# EAGLE schematic Cube-Panel (EAGLE 7.7.0)
Assembly variants: P1, P2, P3, P4, P5, P6

## Sheet 1 of 4
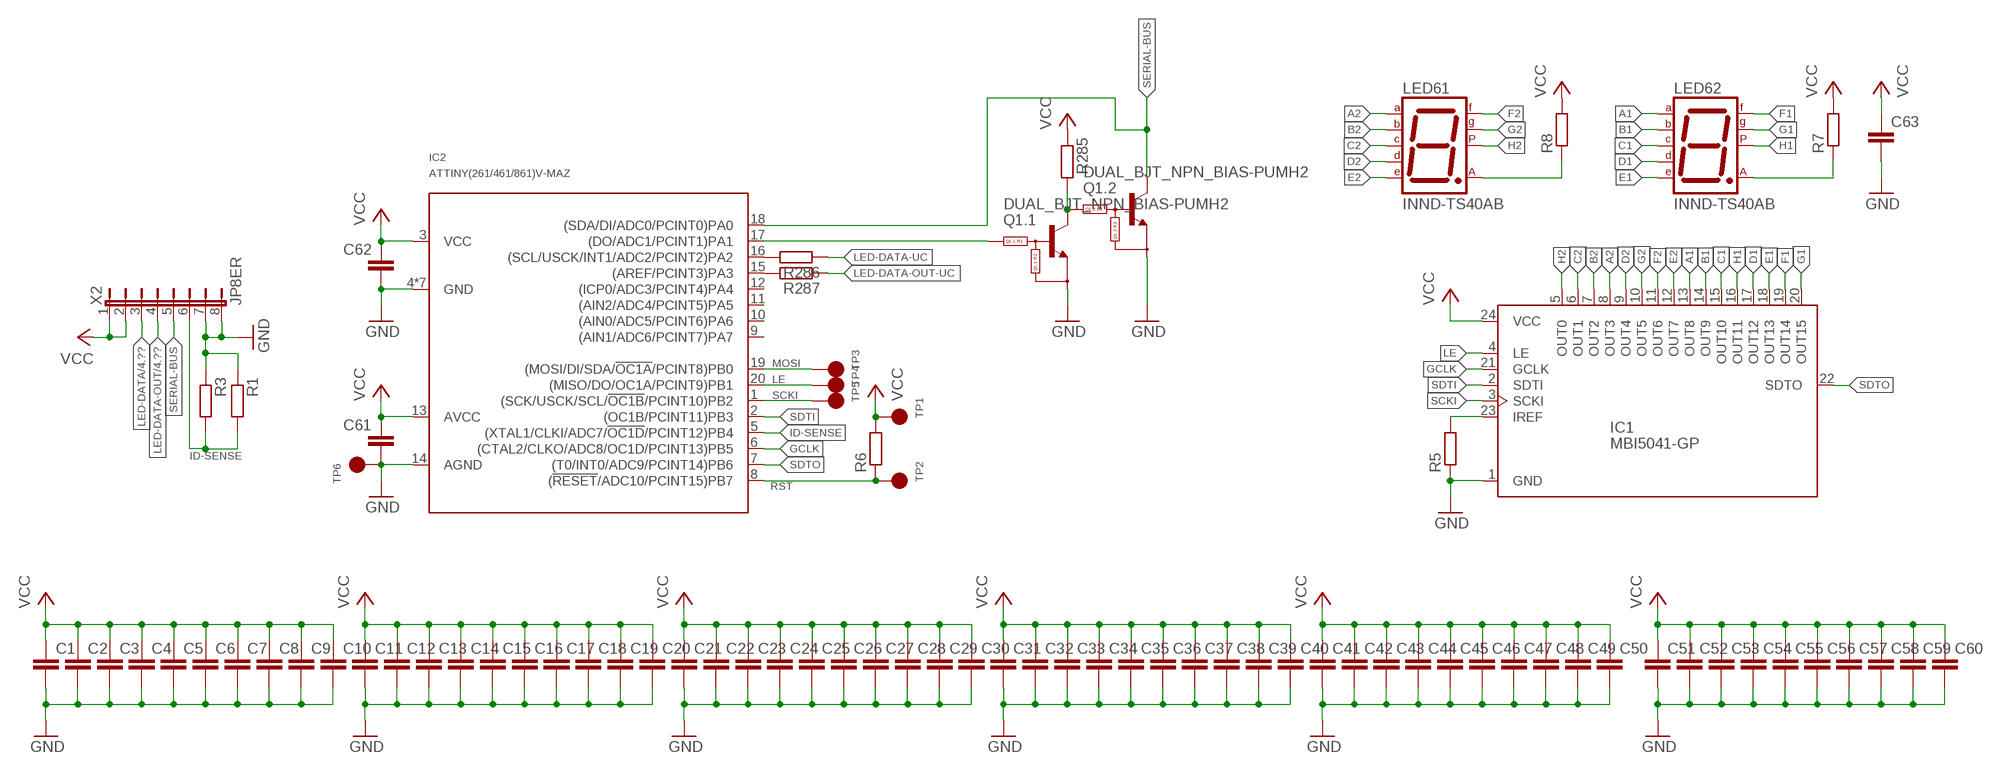
[diagram p0: schematic, sheet 1]

### Parts
C1  KONDENSATOR-0603  [0603]
C2  KONDENSATOR-0603  [0603]
C3  KONDENSATOR-0603  [0603]
C4  KONDENSATOR-0603  [0603]
C5  KONDENSATOR-0603  [0603]
C6  KONDENSATOR-0603  [0603]
C7  KONDENSATOR-0603  [0603]
C8  KONDENSATOR-0603  [0603]
C9  KONDENSATOR-0603  [0603]
C10  KONDENSATOR-0603  [0603]
C11  KONDENSATOR-0603  [0603]
C12  KONDENSATOR-0603  [0603]
C13  KONDENSATOR-0603  [0603]
C14  KONDENSATOR-0603  [0603]
C15  KONDENSATOR-0603  [0603]
C16  KONDENSATOR-0603  [0603]
C17  KONDENSATOR-0603  [0603]
C18  KONDENSATOR-0603  [0603]
C19  KONDENSATOR-0603  [0603]
C20  KONDENSATOR-0603  [0603]
C21  KONDENSATOR-0603  [0603]
C22  KONDENSATOR-0603  [0603]
C23  KONDENSATOR-0603  [0603]
C24  KONDENSATOR-0603  [0603]
C25  KONDENSATOR-0603  [0603]
C26  KONDENSATOR-0603  [0603]
C27  KONDENSATOR-0603  [0603]
C28  KONDENSATOR-0603  [0603]
C29  KONDENSATOR-0603  [0603]
C30  KONDENSATOR-0603  [0603]
C31  KONDENSATOR-0603  [0603]
C32  KONDENSATOR-0603  [0603]
C33  KONDENSATOR-0603  [0603]
C34  KONDENSATOR-0603  [0603]
C35  KONDENSATOR-0603  [0603]
C36  KONDENSATOR-0603  [0603]
C37  KONDENSATOR-0603  [0603]
C38  KONDENSATOR-0603  [0603]
C39  KONDENSATOR-0603  [0603]
C40  KONDENSATOR-0603  [0603]
C41  KONDENSATOR-0603  [0603]
C42  KONDENSATOR-0603  [0603]
C43  KONDENSATOR-0603  [0603]
C44  KONDENSATOR-0603  [0603]
C45  KONDENSATOR-0603  [0603]
C46  KONDENSATOR-0603  [0603]
C47  KONDENSATOR-0603  [0603]
C48  KONDENSATOR-0603  [0603]
C49  KONDENSATOR-0603  [0603]
C50  KONDENSATOR-0603  [0603]
C51  KONDENSATOR-0603  [0603]
C52  KONDENSATOR-0603  [0603]
C53  KONDENSATOR-0603  [0603]
C54  KONDENSATOR-0603  [0603]
C55  KONDENSATOR-0603  [0603]
C56  KONDENSATOR-0603  [0603]
C57  KONDENSATOR-0603  [0603]
C58  KONDENSATOR-0603  [0603]
C59  KONDENSATOR-0603  [0603]
C60  KONDENSATOR-0603  [0603]
C61  KONDENSATOR-0603  [0603]
C62  KONDENSATOR-0603  [0603]
C63  KONDENSATOR-0603  [0603]
IC1  MBI5041-GP  [SSOP24-150-0.635]
IC2  ATTINY(261/461/861)V-MAZ  [QFN-20]
LED61  INND-TS40AB  [7SEG-13]
LED62  INND-TS40AB  [7SEG-13]
Q1  DUAL_BJT_NPN_BIAS-PUMH2  [SOT-363(SC-88)]
R1  WIDERSTAND-0603  [0603]
R3  WIDERSTAND-0603  [0603]
R5  WIDERSTAND-0603  [0603]
R6  WIDERSTAND-0603  [0603]
R7  WIDERSTAND-0603  [0603]
R8  WIDERSTAND-0603  [0603]
R285  WIDERSTAND-0603  [0603]
R286  WIDERSTAND-0603  [0603]
R287  WIDERSTAND-0603  [0603]
TP1  TP  [TP[1.5][R]]
TP2  TP  [TP[1.5][R]]
TP3  TP  [TP[1.5][R]]
TP4  TP  [TP[1.5][R]]
TP5  TP  [TP[1.5][R]]
TP6  TP  [TP[1.5][R]]
X2  JP8ER  [JP8]

### Nets
A1: IC1.13(OUT8) LED62.10(A)
A2: IC1.8(OUT3) LED61.10(A)
B1: IC1.14(OUT9) LED62.9(B)
B2: IC1.7(OUT2) LED61.9(B)
C1: IC1.15(OUT10) LED62.8(C)
C2: IC1.6(OUT1) LED61.8(C)
D1: IC1.17(OUT12) LED62.5(D)
D2: IC1.9(OUT4) LED61.5(D)
E1: IC1.18(OUT13) LED62.1(E)
E2: IC1.12(OUT7) LED61.1(E)
F1: IC1.19(OUT14) LED62.2(F)
F2: IC1.11(OUT6) LED61.2(F)
G1: IC1.20(OUT15) LED62.3(G)
G2: IC1.10(OUT5) LED61.3(G)
GCLK: IC1.21(GCLK) IC2.6((CTAL2/CLKO/ADC8/OC1D/PCINT13)PB5)
GND: C1.P$2 C2.P$2 C3.P$2 C4.P$2 C5.P$2 C6.P$2 C7.P$2 C8.P$2 C9.P$2 C10.P$2 C11.P$2 C12.P$2 C13.P$2 C14.P$2 C15.P$2 C16.P$2 C17.P$2 C18.P$2 C19.P$2 C20.P$2 C21.P$2 C22.P$2 C23.P$2 C24.P$2 C25.P$2 C26.P$2 C27.P$2 C28.P$2 C29.P$2 C30.P$2 C31.P$2 C32.P$2 C33.P$2 C34.P$2 C35.P$2 C36.P$2 C37.P$2 C38.P$2 C39.P$2 C40.P$2 C41.P$2 C42.P$2 C43.P$2 C44.P$2 C45.P$2 C46.P$2 C47.P$2 C48.P$2 C49.P$2 C50.P$2 C51.P$2 C52.P$2 C53.P$2 C54.P$2 C55.P$2 C56.P$2 C57.P$2 C58.P$2 C59.P$2 C60.P$2 C61.P$2 C62.P$2 C63.P$2 IC1.1(GND) IC2.4(GND) IC2.14(AGND) IC2.PAD$1(GND) IC2.PAD$2(GND) IC2.PAD$3(GND) IC2.PAD$4(GND) IC2.PAD$5(GND) IC2.PAD(GND) Q1.1(.1:E) Q1.4(.2:E) R1.P$1 R3.P$1 R5.P$1 TP6.P$1 X2.7 X2.8 ; also sheet 3
H1: IC1.16(OUT11) LED62.7(DP)
H2: IC1.5(OUT0) LED61.7(DP)
ID-SENSE: IC2.5((XTAL1/CLKI/ADC7/!OC1D!/PCINT12)PB4) R1.P$2 R3.P$2 X2.6
LE: IC1.4(LE) IC2.20((MISO/DO/OC1A/PCINT9)PB1) TP4.P$1
LED-DATA: X2.3 ; also sheet 4
LED-DATA-OUT: X2.4 ; also sheet 4
LED-DATA-OUT-UC: R287.P$1 ; also sheet 4
LED-DATA-UC: R286.P$1 ; also sheet 4
MOSI: IC2.19((MOSI/DI/SDA/!OC1A!/PCINT8)PB0) TP3.P$1
N$2: IC1.23(IREF) R5.P$2
N$6: IC2.16((SCL/USCK/INT1/ADC2/PCINT2)PA2) R286.P$2
N$18: Q1.5(.2:B) Q1.6(.1:C) R285.P$2
N$19: IC2.15((AREF/PCINT3)PA3) R287.P$2
N$26: LED61.6(CA2) R8.P$1
N$35: LED62.6(CA2) R7.P$1
RST: IC2.8((!RESET!/ADC10/PCINT15)PB7) R6.P$1 TP2.P$1
SCKI: IC1.3(SCKI) IC2.1((SCK/USCK/SCL/!OC1B!/PCINT10)PB2) TP5.P$1
SDTI: IC1.2(SDTI) IC2.2((OC1B/PCINT11)PB3)
SDTO: IC1.22(SDTO) IC2.7((T0/INT0/ADC9/PCINT14)PB6)
SERIAL-BUS: IC2.18((SDA/DI/ADC0/PCINT0)PA0) Q1.3(.2:C) X2.5
SERIAL-BUS-TX: IC2.17((DO/ADC1/PCINT1)PA1) Q1.2(.1:B)
VCC: C1.P$1 C2.P$1 C3.P$1 C4.P$1 C5.P$1 C6.P$1 C7.P$1 C8.P$1 C9.P$1 C10.P$1 C11.P$1 C12.P$1 C13.P$1 C14.P$1 C15.P$1 C16.P$1 C17.P$1 C18.P$1 C19.P$1 C20.P$1 C21.P$1 C22.P$1 C23.P$1 C24.P$1 C25.P$1 C26.P$1 C27.P$1 C28.P$1 C29.P$1 C30.P$1 C31.P$1 C32.P$1 C33.P$1 C34.P$1 C35.P$1 C36.P$1 C37.P$1 C38.P$1 C39.P$1 C40.P$1 C41.P$1 C42.P$1 C43.P$1 C44.P$1 C45.P$1 C46.P$1 C47.P$1 C48.P$1 C49.P$1 C50.P$1 C51.P$1 C52.P$1 C53.P$1 C54.P$1 C55.P$1 C56.P$1 C57.P$1 C58.P$1 C59.P$1 C60.P$1 C61.P$1 C62.P$1 C63.P$1 IC1.24(VCC) IC2.3(VCC) IC2.13(AVCC) R6.P$2 R7.P$2 R8.P$2 R285.P$1 TP1.P$1 X2.1 X2.2 ; also sheet 3
Unconnected: IC2.9((AIN1/ADC6/PCINT7)PA7) IC2.10((AIN0/ADC5/PCINT6)PA6) IC2.11((AIN2/ADC4/PCINT5)PA5) IC2.12((ICP0/ADC3/PCINT4)PA4)

## Sheet 2 of 4: CON
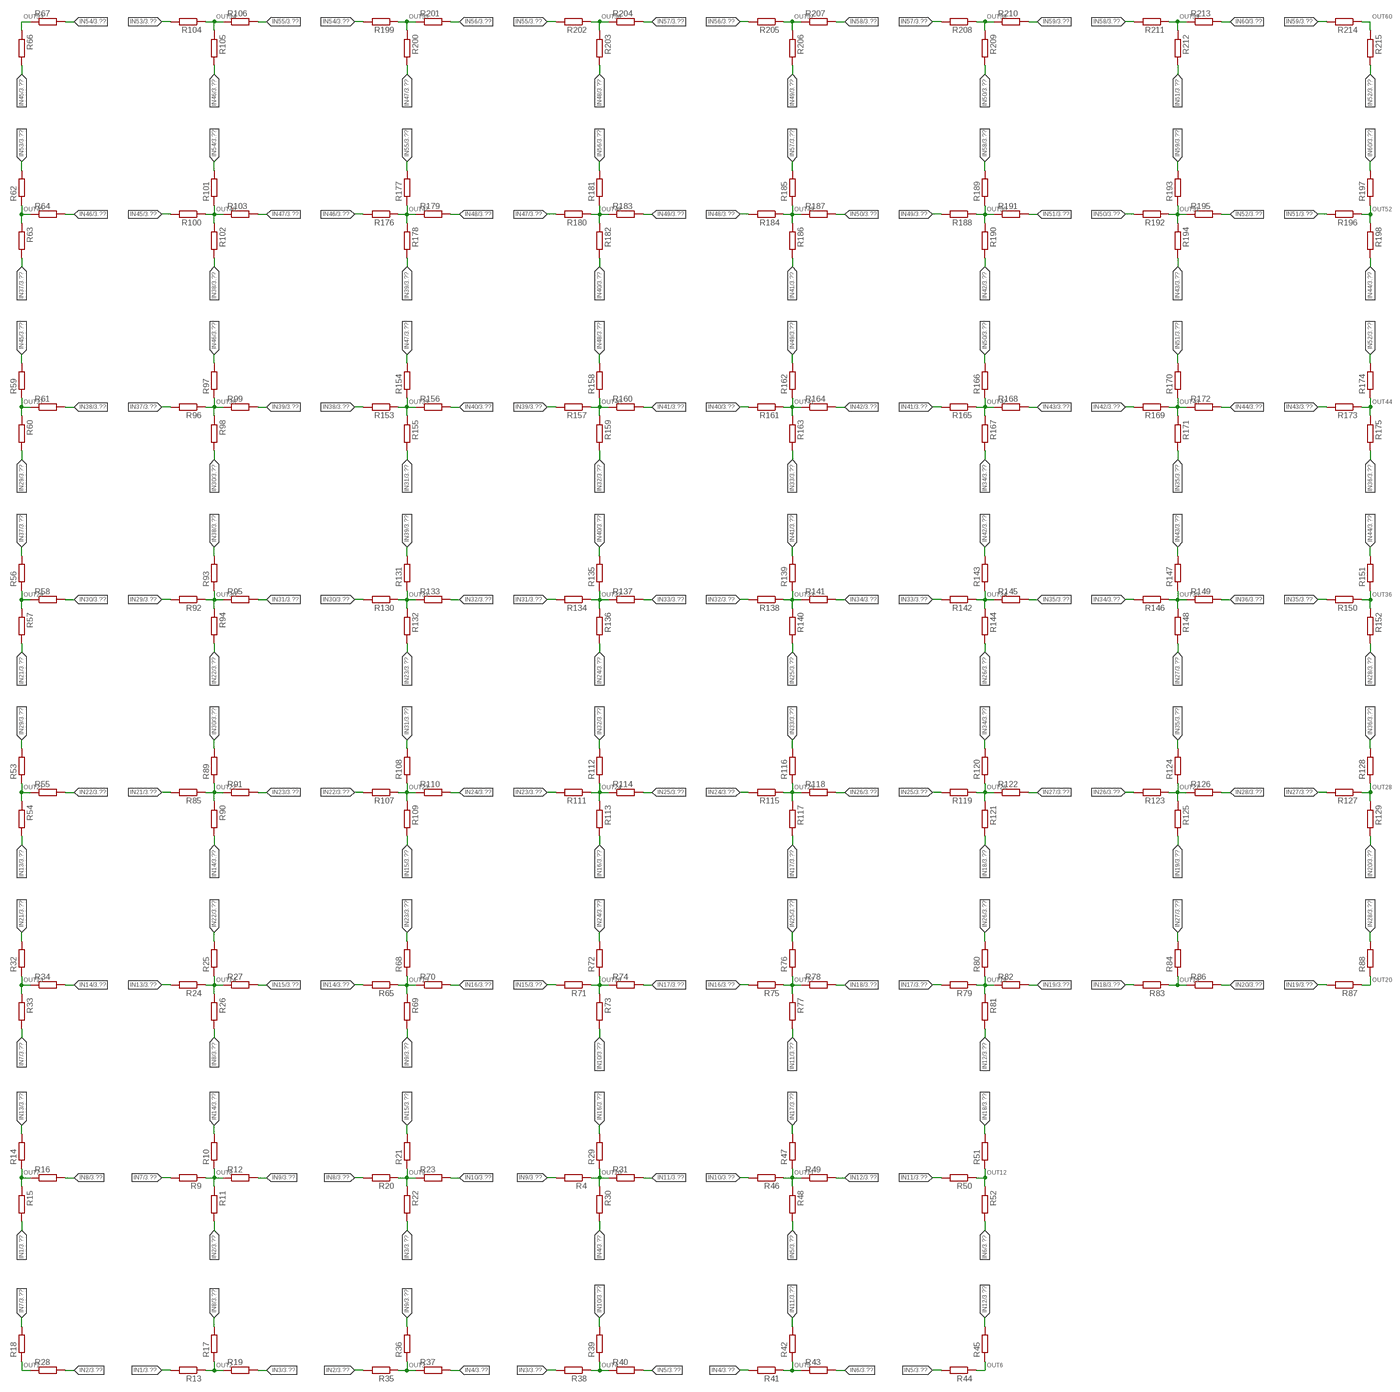
[diagram p1: schematic, sheet 2, overview]
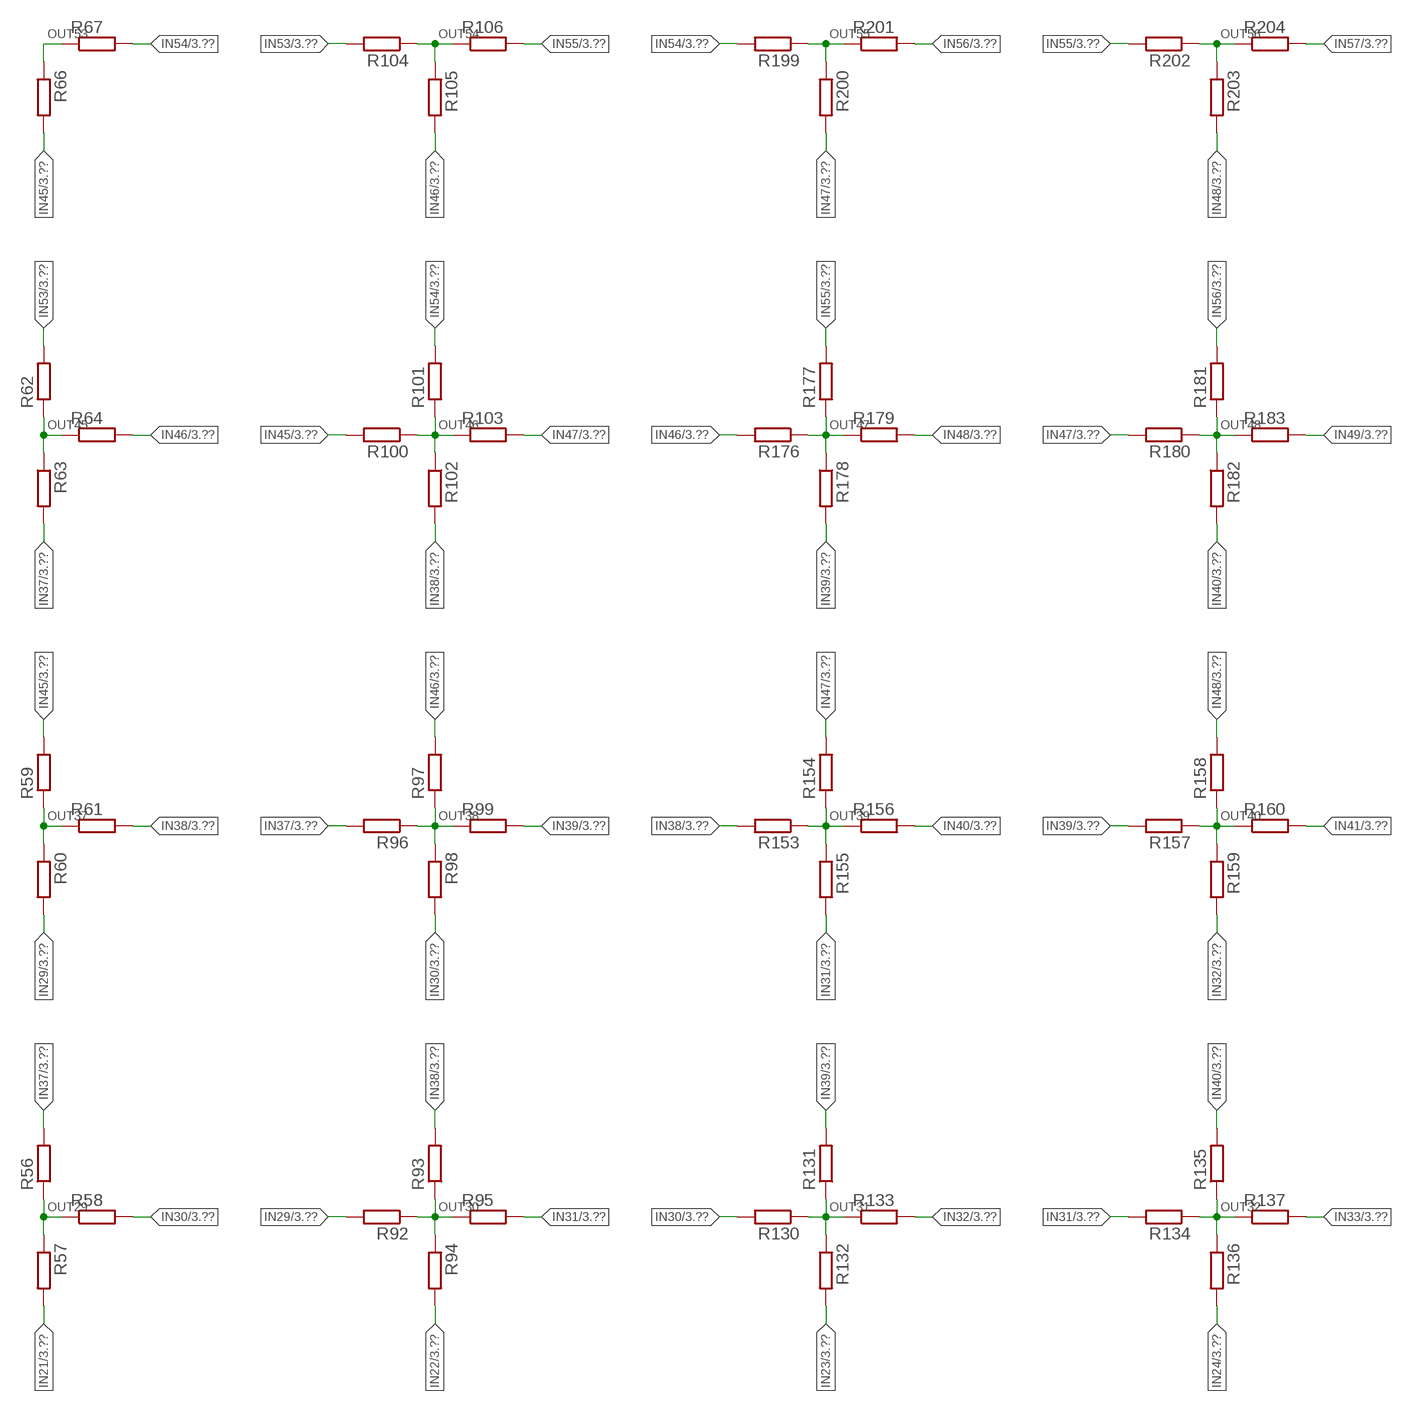
[diagram p2: schematic, sheet 2, part 1 of 4]
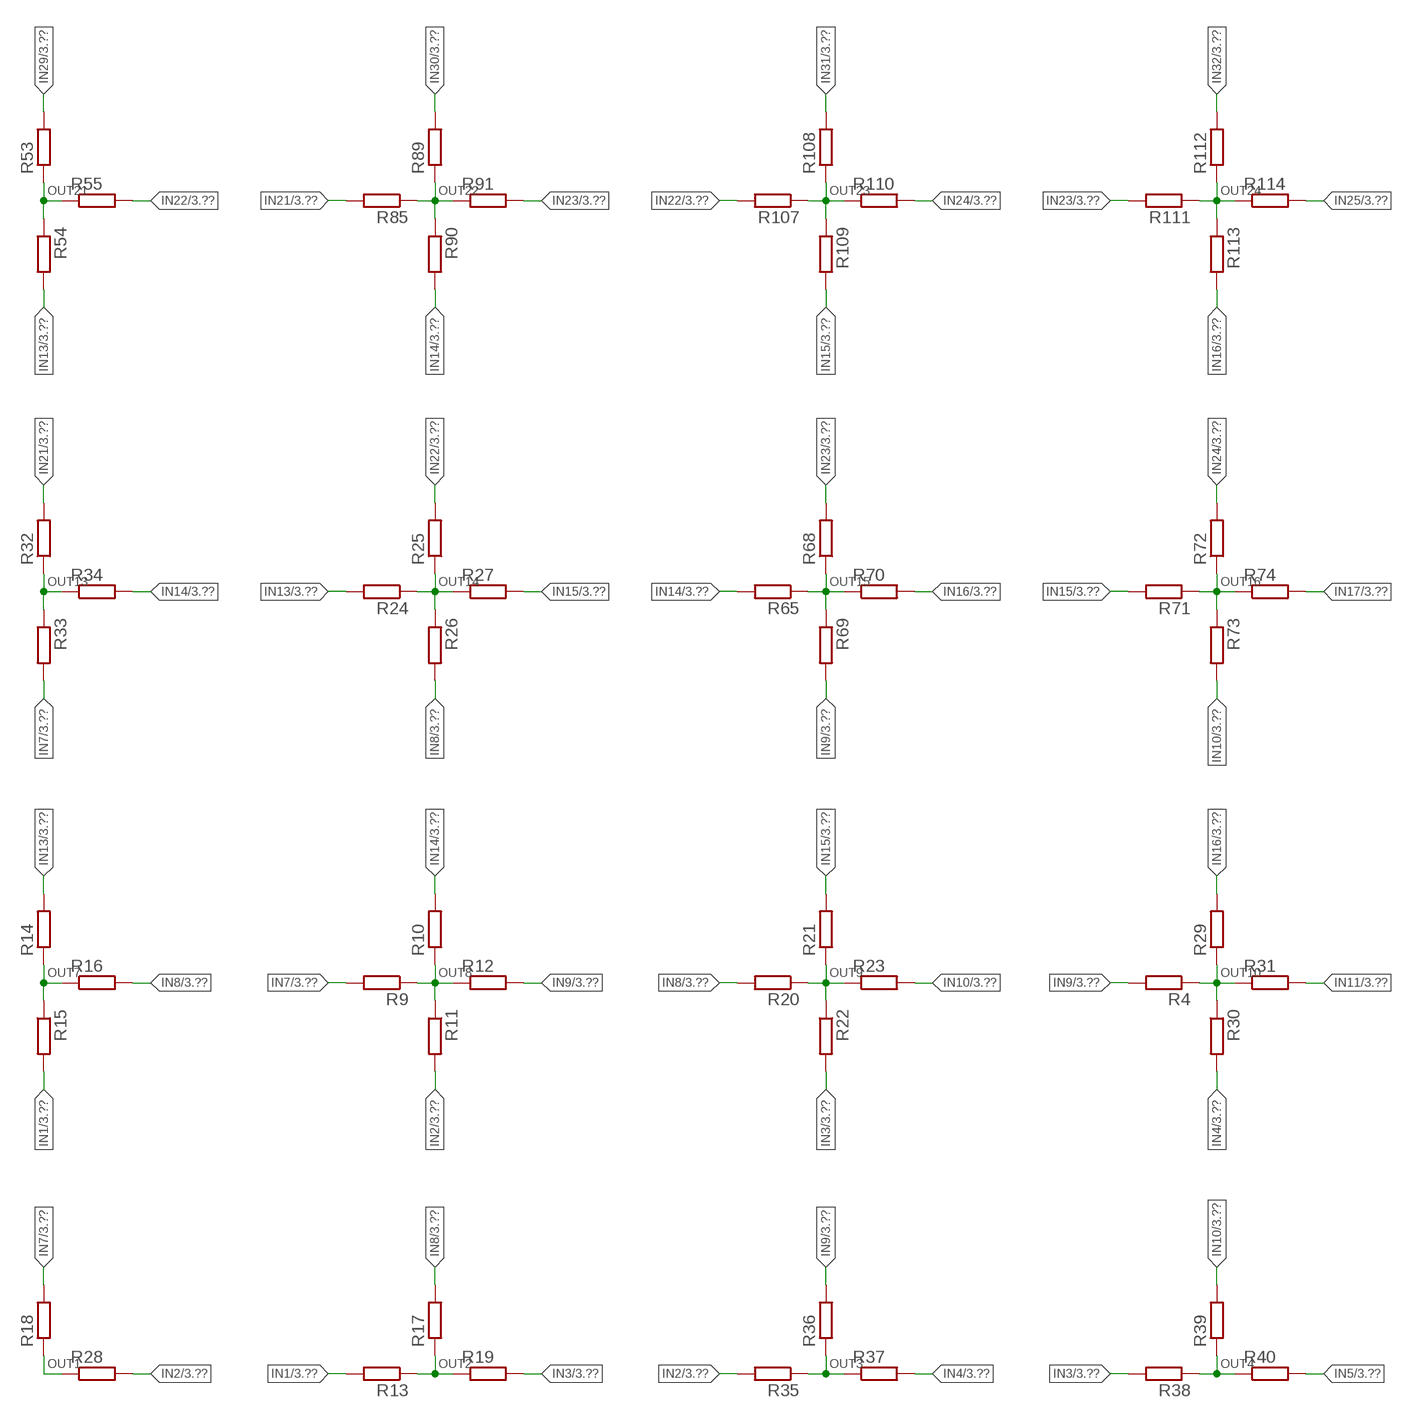
[diagram p3: schematic, sheet 2, part 2 of 4]
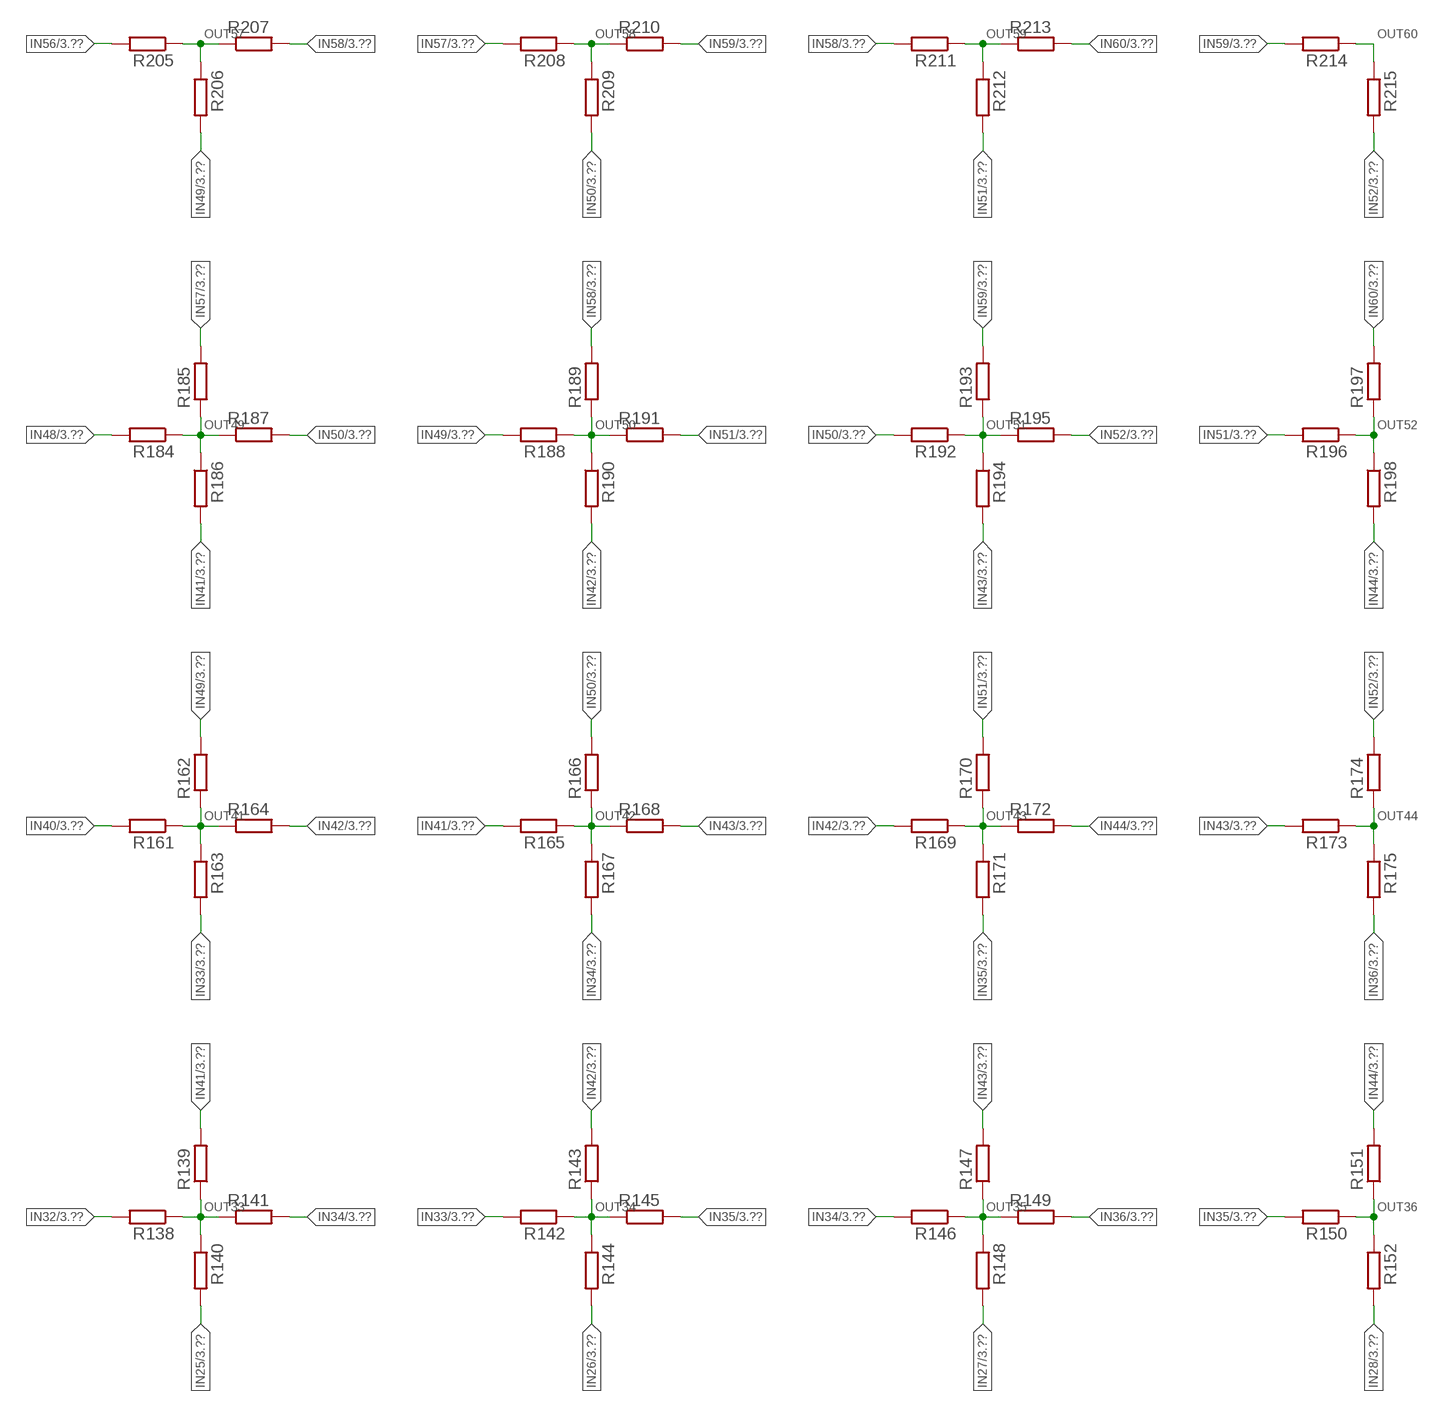
[diagram p4: schematic, sheet 2, part 3 of 4]
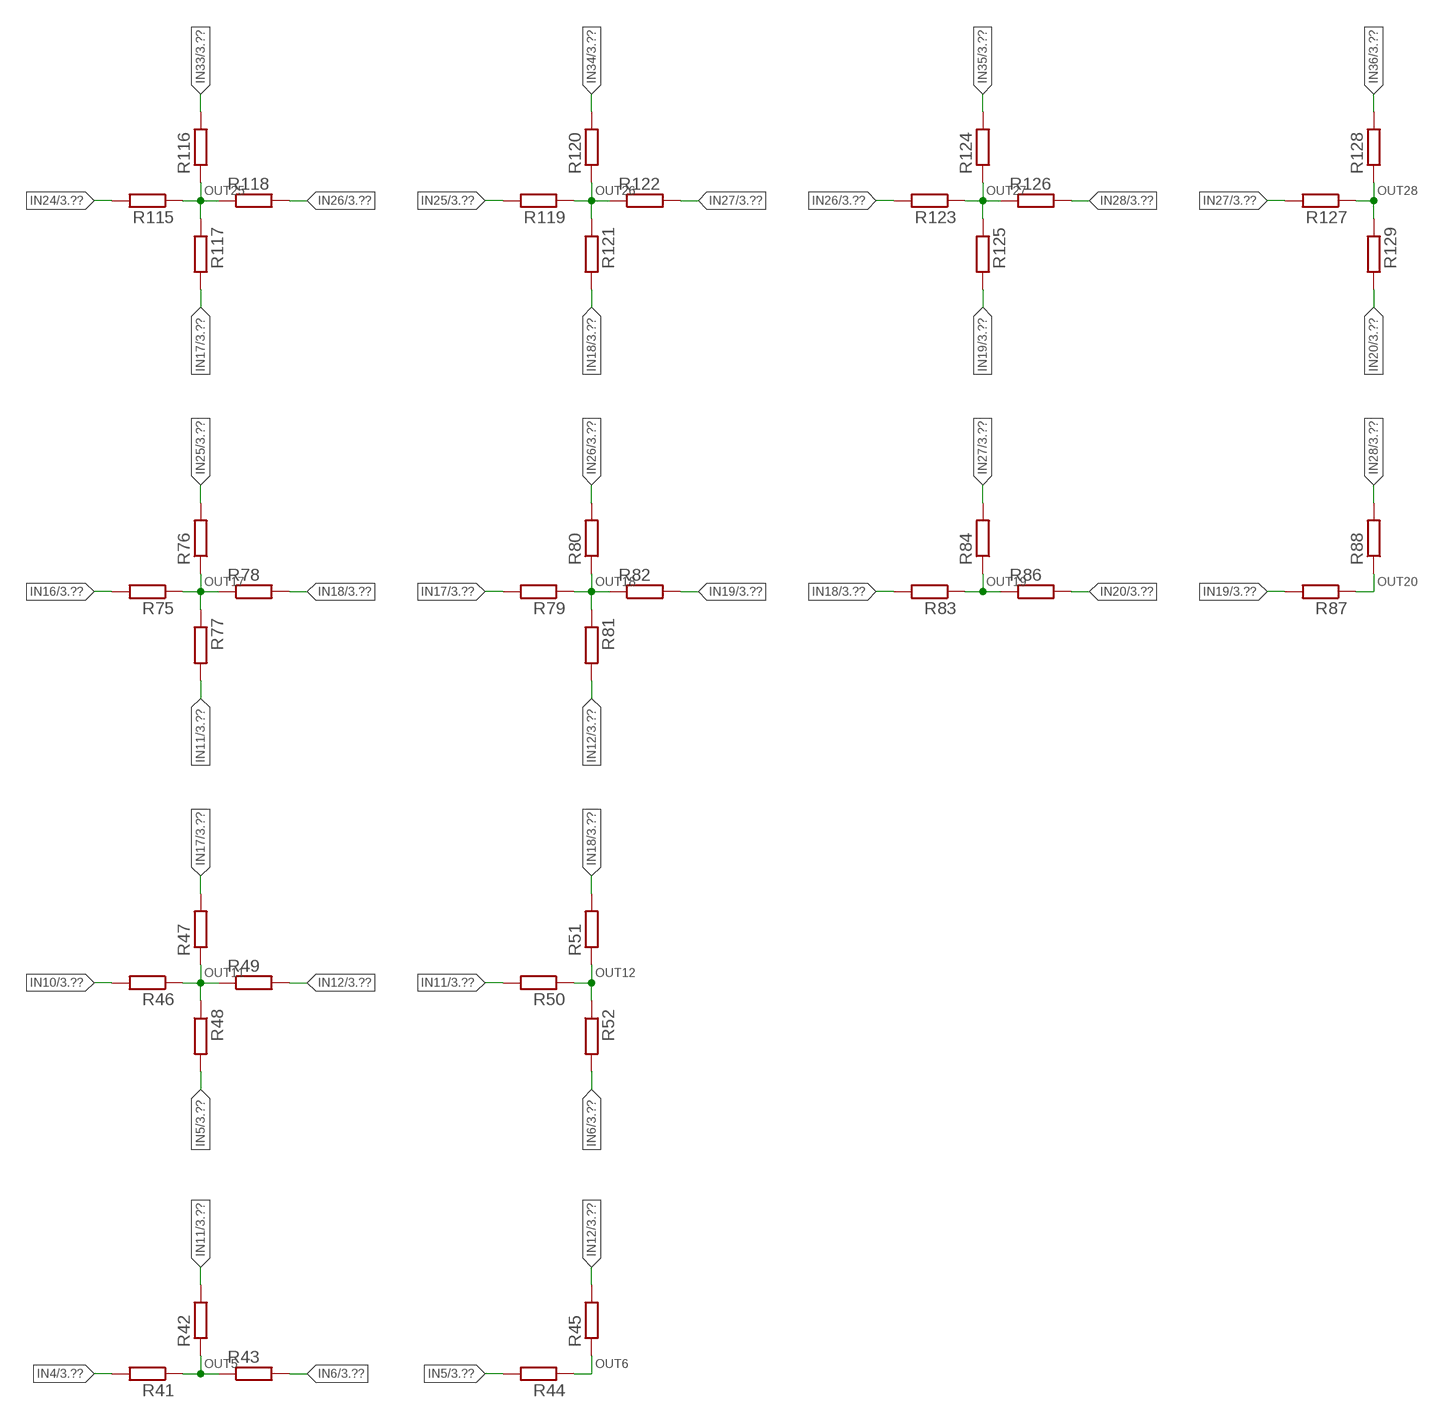
[diagram p5: schematic, sheet 2, part 4 of 4]

### Parts
R4  WIDERSTAND-0603  [0603]
R9  WIDERSTAND-0603  [0603]
R10  WIDERSTAND-0603  [0603]
R11  WIDERSTAND-0603  [0603]
R12  WIDERSTAND-0603  [0603]
R13  WIDERSTAND-0603  [0603]
R14  WIDERSTAND-0603  [0603]
R15  WIDERSTAND-0603  [0603]
R16  WIDERSTAND-0603  [0603]
R17  WIDERSTAND-0603  [0603]
R18  WIDERSTAND-0603  [0603]
R19  WIDERSTAND-0603  [0603]
R20  WIDERSTAND-0603  [0603]
R21  WIDERSTAND-0603  [0603]
R22  WIDERSTAND-0603  [0603]
R23  WIDERSTAND-0603  [0603]
R24  WIDERSTAND-0603  [0603]
R25  WIDERSTAND-0603  [0603]
R26  WIDERSTAND-0603  [0603]
R27  WIDERSTAND-0603  [0603]
R28  WIDERSTAND-0603  [0603]
R29  WIDERSTAND-0603  [0603]
R30  WIDERSTAND-0603  [0603]
R31  WIDERSTAND-0603  [0603]
R32  WIDERSTAND-0603  [0603]
R33  WIDERSTAND-0603  [0603]
R34  WIDERSTAND-0603  [0603]
R35  WIDERSTAND-0603  [0603]
R36  WIDERSTAND-0603  [0603]
R37  WIDERSTAND-0603  [0603]
R38  WIDERSTAND-0603  [0603]
R39  WIDERSTAND-0603  [0603]
R40  WIDERSTAND-0603  [0603]
R41  WIDERSTAND-0603  [0603]
R42  WIDERSTAND-0603  [0603]
R43  WIDERSTAND-0603  [0603]
R44  WIDERSTAND-0603  [0603]
R45  WIDERSTAND-0603  [0603]
R46  WIDERSTAND-0603  [0603]
R47  WIDERSTAND-0603  [0603]
R48  WIDERSTAND-0603  [0603]
R49  WIDERSTAND-0603  [0603]
R50  WIDERSTAND-0603  [0603]
R51  WIDERSTAND-0603  [0603]
R52  WIDERSTAND-0603  [0603]
R53  WIDERSTAND-0603  [0603]
R54  WIDERSTAND-0603  [0603]
R55  WIDERSTAND-0603  [0603]
R56  WIDERSTAND-0603  [0603]
R57  WIDERSTAND-0603  [0603]
R58  WIDERSTAND-0603  [0603]
R59  WIDERSTAND-0603  [0603]
R60  WIDERSTAND-0603  [0603]
R61  WIDERSTAND-0603  [0603]
R62  WIDERSTAND-0603  [0603]
R63  WIDERSTAND-0603  [0603]
R64  WIDERSTAND-0603  [0603]
R65  WIDERSTAND-0603  [0603]
R66  WIDERSTAND-0603  [0603]
R67  WIDERSTAND-0603  [0603]
R68  WIDERSTAND-0603  [0603]
R69  WIDERSTAND-0603  [0603]
R70  WIDERSTAND-0603  [0603]
R71  WIDERSTAND-0603  [0603]
R72  WIDERSTAND-0603  [0603]
R73  WIDERSTAND-0603  [0603]
R74  WIDERSTAND-0603  [0603]
R75  WIDERSTAND-0603  [0603]
R76  WIDERSTAND-0603  [0603]
R77  WIDERSTAND-0603  [0603]
R78  WIDERSTAND-0603  [0603]
R79  WIDERSTAND-0603  [0603]
R80  WIDERSTAND-0603  [0603]
R81  WIDERSTAND-0603  [0603]
R82  WIDERSTAND-0603  [0603]
R83  WIDERSTAND-0603  [0603]
R84  WIDERSTAND-0603  [0603]
R85  WIDERSTAND-0603  [0603]
R86  WIDERSTAND-0603  [0603]
R87  WIDERSTAND-0603  [0603]
R88  WIDERSTAND-0603  [0603]
R89  WIDERSTAND-0603  [0603]
R90  WIDERSTAND-0603  [0603]
R91  WIDERSTAND-0603  [0603]
R92  WIDERSTAND-0603  [0603]
R93  WIDERSTAND-0603  [0603]
R94  WIDERSTAND-0603  [0603]
R95  WIDERSTAND-0603  [0603]
R96  WIDERSTAND-0603  [0603]
R97  WIDERSTAND-0603  [0603]
R98  WIDERSTAND-0603  [0603]
R99  WIDERSTAND-0603  [0603]
R100  WIDERSTAND-0603  [0603]
R101  WIDERSTAND-0603  [0603]
R102  WIDERSTAND-0603  [0603]
R103  WIDERSTAND-0603  [0603]
R104  WIDERSTAND-0603  [0603]
R105  WIDERSTAND-0603  [0603]
R106  WIDERSTAND-0603  [0603]
R107  WIDERSTAND-0603  [0603]
R108  WIDERSTAND-0603  [0603]
R109  WIDERSTAND-0603  [0603]
R110  WIDERSTAND-0603  [0603]
R111  WIDERSTAND-0603  [0603]
R112  WIDERSTAND-0603  [0603]
R113  WIDERSTAND-0603  [0603]
R114  WIDERSTAND-0603  [0603]
R115  WIDERSTAND-0603  [0603]
R116  WIDERSTAND-0603  [0603]
R117  WIDERSTAND-0603  [0603]
R118  WIDERSTAND-0603  [0603]
R119  WIDERSTAND-0603  [0603]
R120  WIDERSTAND-0603  [0603]
R121  WIDERSTAND-0603  [0603]
R122  WIDERSTAND-0603  [0603]
R123  WIDERSTAND-0603  [0603]
R124  WIDERSTAND-0603  [0603]
R125  WIDERSTAND-0603  [0603]
R126  WIDERSTAND-0603  [0603]
R127  WIDERSTAND-0603  [0603]
R128  WIDERSTAND-0603  [0603]
R129  WIDERSTAND-0603  [0603]
R130  WIDERSTAND-0603  [0603]
R131  WIDERSTAND-0603  [0603]
R132  WIDERSTAND-0603  [0603]
R133  WIDERSTAND-0603  [0603]
R134  WIDERSTAND-0603  [0603]
R135  WIDERSTAND-0603  [0603]
R136  WIDERSTAND-0603  [0603]
R137  WIDERSTAND-0603  [0603]
R138  WIDERSTAND-0603  [0603]
R139  WIDERSTAND-0603  [0603]
R140  WIDERSTAND-0603  [0603]
R141  WIDERSTAND-0603  [0603]
R142  WIDERSTAND-0603  [0603]
R143  WIDERSTAND-0603  [0603]
R144  WIDERSTAND-0603  [0603]
R145  WIDERSTAND-0603  [0603]
R146  WIDERSTAND-0603  [0603]
R147  WIDERSTAND-0603  [0603]
R148  WIDERSTAND-0603  [0603]
R149  WIDERSTAND-0603  [0603]
R150  WIDERSTAND-0603  [0603]
R151  WIDERSTAND-0603  [0603]
R152  WIDERSTAND-0603  [0603]
R153  WIDERSTAND-0603  [0603]
R154  WIDERSTAND-0603  [0603]
R155  WIDERSTAND-0603  [0603]
R156  WIDERSTAND-0603  [0603]
R157  WIDERSTAND-0603  [0603]
R158  WIDERSTAND-0603  [0603]
R159  WIDERSTAND-0603  [0603]
R160  WIDERSTAND-0603  [0603]
R161  WIDERSTAND-0603  [0603]
R162  WIDERSTAND-0603  [0603]
R163  WIDERSTAND-0603  [0603]
R164  WIDERSTAND-0603  [0603]
R165  WIDERSTAND-0603  [0603]
R166  WIDERSTAND-0603  [0603]
R167  WIDERSTAND-0603  [0603]
R168  WIDERSTAND-0603  [0603]
R169  WIDERSTAND-0603  [0603]
R170  WIDERSTAND-0603  [0603]
R171  WIDERSTAND-0603  [0603]
R172  WIDERSTAND-0603  [0603]
R173  WIDERSTAND-0603  [0603]
R174  WIDERSTAND-0603  [0603]
R175  WIDERSTAND-0603  [0603]
R176  WIDERSTAND-0603  [0603]
R177  WIDERSTAND-0603  [0603]
R178  WIDERSTAND-0603  [0603]
R179  WIDERSTAND-0603  [0603]
R180  WIDERSTAND-0603  [0603]
R181  WIDERSTAND-0603  [0603]
R182  WIDERSTAND-0603  [0603]
R183  WIDERSTAND-0603  [0603]
R184  WIDERSTAND-0603  [0603]
R185  WIDERSTAND-0603  [0603]
R186  WIDERSTAND-0603  [0603]
R187  WIDERSTAND-0603  [0603]
R188  WIDERSTAND-0603  [0603]
R189  WIDERSTAND-0603  [0603]
R190  WIDERSTAND-0603  [0603]
R191  WIDERSTAND-0603  [0603]
R192  WIDERSTAND-0603  [0603]
R193  WIDERSTAND-0603  [0603]
R194  WIDERSTAND-0603  [0603]
R195  WIDERSTAND-0603  [0603]
R196  WIDERSTAND-0603  [0603]
R197  WIDERSTAND-0603  [0603]
R198  WIDERSTAND-0603  [0603]
R199  WIDERSTAND-0603  [0603]
R200  WIDERSTAND-0603  [0603]
R201  WIDERSTAND-0603  [0603]
R202  WIDERSTAND-0603  [0603]
R203  WIDERSTAND-0603  [0603]
R204  WIDERSTAND-0603  [0603]
R205  WIDERSTAND-0603  [0603]
R206  WIDERSTAND-0603  [0603]
R207  WIDERSTAND-0603  [0603]
R208  WIDERSTAND-0603  [0603]
R209  WIDERSTAND-0603  [0603]
R210  WIDERSTAND-0603  [0603]
R211  WIDERSTAND-0603  [0603]
R212  WIDERSTAND-0603  [0603]
R213  WIDERSTAND-0603  [0603]
R214  WIDERSTAND-0603  [0603]
R215  WIDERSTAND-0603  [0603]

### Nets
IN1: R13.P$2 R15.P$2 ; also sheet 3,4
IN2: R11.P$2 R28.P$2 R35.P$2 ; also sheet 3,4
IN3: R19.P$2 R22.P$2 R38.P$2 ; also sheet 3,4
IN4: R30.P$2 R37.P$2 R41.P$2 ; also sheet 3,4
IN5: R40.P$2 R44.P$2 R48.P$2 ; also sheet 3,4
IN6: R43.P$2 R52.P$2 ; also sheet 3,4
IN7: R9.P$2 R18.P$2 R33.P$2 ; also sheet 3,4
IN8: R16.P$2 R17.P$2 R20.P$2 R26.P$2 ; also sheet 3,4
IN9: R4.P$2 R12.P$2 R36.P$2 R69.P$2 ; also sheet 3,4
IN10: R23.P$2 R39.P$2 R46.P$2 R73.P$2 ; also sheet 3,4
IN11: R31.P$2 R42.P$2 R50.P$2 R77.P$2 ; also sheet 3,4
IN12: R45.P$2 R49.P$2 R81.P$2 ; also sheet 3,4
IN13: R14.P$2 R24.P$2 R54.P$2 ; also sheet 3,4
IN14: R10.P$2 R34.P$2 R65.P$2 R90.P$2 ; also sheet 3,4
IN15: R21.P$2 R27.P$2 R71.P$2 R109.P$2 ; also sheet 3,4
IN16: R29.P$2 R70.P$2 R75.P$2 R113.P$2 ; also sheet 3,4
IN17: R47.P$2 R74.P$2 R79.P$2 R117.P$2 ; also sheet 3,4
IN18: R51.P$2 R78.P$2 R83.P$2 R121.P$2 ; also sheet 3,4
IN19: R82.P$2 R87.P$2 R125.P$2 ; also sheet 3,4
IN20: R86.P$2 R129.P$2 ; also sheet 3,4
IN21: R32.P$2 R57.P$2 R85.P$2 ; also sheet 3,4
IN22: R25.P$2 R55.P$2 R94.P$2 R107.P$2 ; also sheet 3,4
IN23: R68.P$2 R91.P$2 R111.P$2 R132.P$2 ; also sheet 3,4
IN24: R72.P$2 R110.P$2 R115.P$2 R136.P$2 ; also sheet 3,4
IN25: R76.P$2 R114.P$2 R119.P$2 R140.P$2 ; also sheet 3,4
IN26: R80.P$2 R118.P$2 R123.P$2 R144.P$2 ; also sheet 3,4
IN27: R84.P$2 R122.P$2 R127.P$2 R148.P$2 ; also sheet 3,4
IN28: R88.P$2 R126.P$2 R152.P$2 ; also sheet 3,4
IN29: R53.P$2 R60.P$2 R92.P$2 ; also sheet 3,4
IN30: R58.P$2 R89.P$2 R98.P$2 R130.P$2 ; also sheet 3,4
IN31: R95.P$2 R108.P$2 R134.P$2 R155.P$2 ; also sheet 3,4
IN32: R112.P$2 R133.P$2 R138.P$2 R159.P$2 ; also sheet 3,4
IN33: R116.P$2 R137.P$2 R142.P$2 R163.P$2 ; also sheet 3,4
IN34: R120.P$2 R141.P$2 R146.P$2 R167.P$2 ; also sheet 3,4
IN35: R124.P$2 R145.P$2 R150.P$2 R171.P$2 ; also sheet 3,4
IN36: R128.P$2 R149.P$2 R175.P$2 ; also sheet 3,4
IN37: R56.P$2 R63.P$2 R96.P$2 ; also sheet 3,4
IN38: R61.P$2 R93.P$2 R102.P$2 R153.P$2 ; also sheet 3,4
IN39: R99.P$2 R131.P$2 R157.P$2 R178.P$2 ; also sheet 3,4
IN40: R135.P$2 R156.P$2 R161.P$2 R182.P$2 ; also sheet 3,4
IN41: R139.P$2 R160.P$2 R165.P$2 R186.P$2 ; also sheet 3,4
IN42: R143.P$2 R164.P$2 R169.P$2 R190.P$2 ; also sheet 3,4
IN43: R147.P$2 R168.P$2 R173.P$2 R194.P$2 ; also sheet 3,4
IN44: R151.P$2 R172.P$2 R198.P$2 ; also sheet 3,4
IN45: R59.P$2 R66.P$2 R100.P$2 ; also sheet 3,4
IN46: R64.P$2 R97.P$2 R105.P$2 R176.P$2 ; also sheet 3,4
IN47: R103.P$2 R154.P$2 R180.P$2 R200.P$2 ; also sheet 3,4
IN48: R158.P$2 R179.P$2 R184.P$2 R203.P$2 ; also sheet 3,4
IN49: R162.P$2 R183.P$2 R188.P$2 R206.P$2 ; also sheet 3,4
IN50: R166.P$2 R187.P$2 R192.P$2 R209.P$2 ; also sheet 3,4
IN51: R170.P$2 R191.P$2 R196.P$2 R212.P$2 ; also sheet 3,4
IN52: R174.P$2 R195.P$2 R215.P$2 ; also sheet 3,4
IN53: R62.P$2 R104.P$2 ; also sheet 3,4
IN54: R67.P$2 R101.P$2 R199.P$2 ; also sheet 3,4
IN55: R106.P$2 R177.P$2 R202.P$2 ; also sheet 3,4
IN56: R181.P$2 R201.P$2 R205.P$2 ; also sheet 3,4
IN57: R185.P$2 R204.P$2 R208.P$2 ; also sheet 3,4
IN58: R189.P$2 R207.P$2 R211.P$2 ; also sheet 3,4
IN59: R193.P$2 R210.P$2 R214.P$2 ; also sheet 3,4
IN60: R197.P$2 R213.P$2 ; also sheet 3,4
OUT1: R18.P$1 R28.P$1 ; also sheet 3,4
OUT2: R13.P$1 R17.P$1 R19.P$1 ; also sheet 3,4
OUT3: R35.P$1 R36.P$1 R37.P$1 ; also sheet 3,4
OUT4: R38.P$1 R39.P$1 R40.P$1 ; also sheet 3,4
OUT5: R41.P$1 R42.P$1 R43.P$1 ; also sheet 3,4
OUT6: R44.P$1 R45.P$1 ; also sheet 3,4
OUT7: R14.P$1 R15.P$1 R16.P$1 ; also sheet 3,4
OUT8: R9.P$1 R10.P$1 R11.P$1 R12.P$1 ; also sheet 3,4
OUT9: R20.P$1 R21.P$1 R22.P$1 R23.P$1 ; also sheet 3,4
OUT10: R4.P$1 R29.P$1 R30.P$1 R31.P$1 ; also sheet 3,4
OUT11: R46.P$1 R47.P$1 R48.P$1 R49.P$1 ; also sheet 3,4
OUT12: R50.P$1 R51.P$1 R52.P$1 ; also sheet 3,4
OUT13: R32.P$1 R33.P$1 R34.P$1 ; also sheet 3,4
OUT14: R24.P$1 R25.P$1 R26.P$1 R27.P$1 ; also sheet 3,4
OUT15: R65.P$1 R68.P$1 R69.P$1 R70.P$1 ; also sheet 3,4
OUT16: R71.P$1 R72.P$1 R73.P$1 R74.P$1 ; also sheet 3,4
OUT17: R75.P$1 R76.P$1 R77.P$1 R78.P$1 ; also sheet 3,4
OUT18: R79.P$1 R80.P$1 R81.P$1 R82.P$1 ; also sheet 3,4
OUT19: R83.P$1 R84.P$1 R86.P$1 ; also sheet 3,4
OUT20: R87.P$1 R88.P$1 ; also sheet 3,4
OUT21: R53.P$1 R54.P$1 R55.P$1 ; also sheet 3,4
OUT22: R85.P$1 R89.P$1 R90.P$1 R91.P$1 ; also sheet 3,4
OUT23: R107.P$1 R108.P$1 R109.P$1 R110.P$1 ; also sheet 3,4
OUT24: R111.P$1 R112.P$1 R113.P$1 R114.P$1 ; also sheet 3,4
OUT25: R115.P$1 R116.P$1 R117.P$1 R118.P$1 ; also sheet 3,4
OUT26: R119.P$1 R120.P$1 R121.P$1 R122.P$1 ; also sheet 3,4
OUT27: R123.P$1 R124.P$1 R125.P$1 R126.P$1 ; also sheet 3,4
OUT28: R127.P$1 R128.P$1 R129.P$1 ; also sheet 3,4
OUT29: R56.P$1 R57.P$1 R58.P$1 ; also sheet 3,4
OUT30: R92.P$1 R93.P$1 R94.P$1 R95.P$1 ; also sheet 3,4
OUT31: R130.P$1 R131.P$1 R132.P$1 R133.P$1 ; also sheet 3,4
OUT32: R134.P$1 R135.P$1 R136.P$1 R137.P$1 ; also sheet 3,4
OUT33: R138.P$1 R139.P$1 R140.P$1 R141.P$1 ; also sheet 3,4
OUT34: R142.P$1 R143.P$1 R144.P$1 R145.P$1 ; also sheet 3,4
OUT35: R146.P$1 R147.P$1 R148.P$1 R149.P$1 ; also sheet 3,4
OUT36: R150.P$1 R151.P$1 R152.P$1 ; also sheet 3,4
OUT37: R59.P$1 R60.P$1 R61.P$1 ; also sheet 3,4
OUT38: R96.P$1 R97.P$1 R98.P$1 R99.P$1 ; also sheet 3,4
OUT39: R153.P$1 R154.P$1 R155.P$1 R156.P$1 ; also sheet 3,4
OUT40: R157.P$1 R158.P$1 R159.P$1 R160.P$1 ; also sheet 3,4
OUT41: R161.P$1 R162.P$1 R163.P$1 R164.P$1 ; also sheet 3,4
OUT42: R165.P$1 R166.P$1 R167.P$1 R168.P$1 ; also sheet 3,4
OUT43: R169.P$1 R170.P$1 R171.P$1 R172.P$1 ; also sheet 3,4
OUT44: R173.P$1 R174.P$1 R175.P$1 ; also sheet 3,4
OUT45: R62.P$1 R63.P$1 R64.P$1 ; also sheet 3,4
OUT46: R100.P$1 R101.P$1 R102.P$1 R103.P$1 ; also sheet 3,4
OUT47: R176.P$1 R177.P$1 R178.P$1 R179.P$1 ; also sheet 3,4
OUT48: R180.P$1 R181.P$1 R182.P$1 R183.P$1 ; also sheet 3,4
OUT49: R184.P$1 R185.P$1 R186.P$1 R187.P$1 ; also sheet 3,4
OUT50: R188.P$1 R189.P$1 R190.P$1 R191.P$1 ; also sheet 3,4
OUT51: R192.P$1 R193.P$1 R194.P$1 R195.P$1 ; also sheet 3,4
OUT52: R196.P$1 R197.P$1 R198.P$1 ; also sheet 3,4
OUT53: R66.P$1 R67.P$1 ; also sheet 3,4
OUT54: R104.P$1 R105.P$1 R106.P$1 ; also sheet 3,4
OUT55: R199.P$1 R200.P$1 R201.P$1 ; also sheet 3,4
OUT56: R202.P$1 R203.P$1 R204.P$1 ; also sheet 3,4
OUT57: R205.P$1 R206.P$1 R207.P$1 ; also sheet 3,4
OUT58: R208.P$1 R209.P$1 R210.P$1 ; also sheet 3,4
OUT59: R211.P$1 R212.P$1 R213.P$1 ; also sheet 3,4
OUT60: R214.P$1 R215.P$1 ; also sheet 3,4

## Sheet 3 of 4: LED
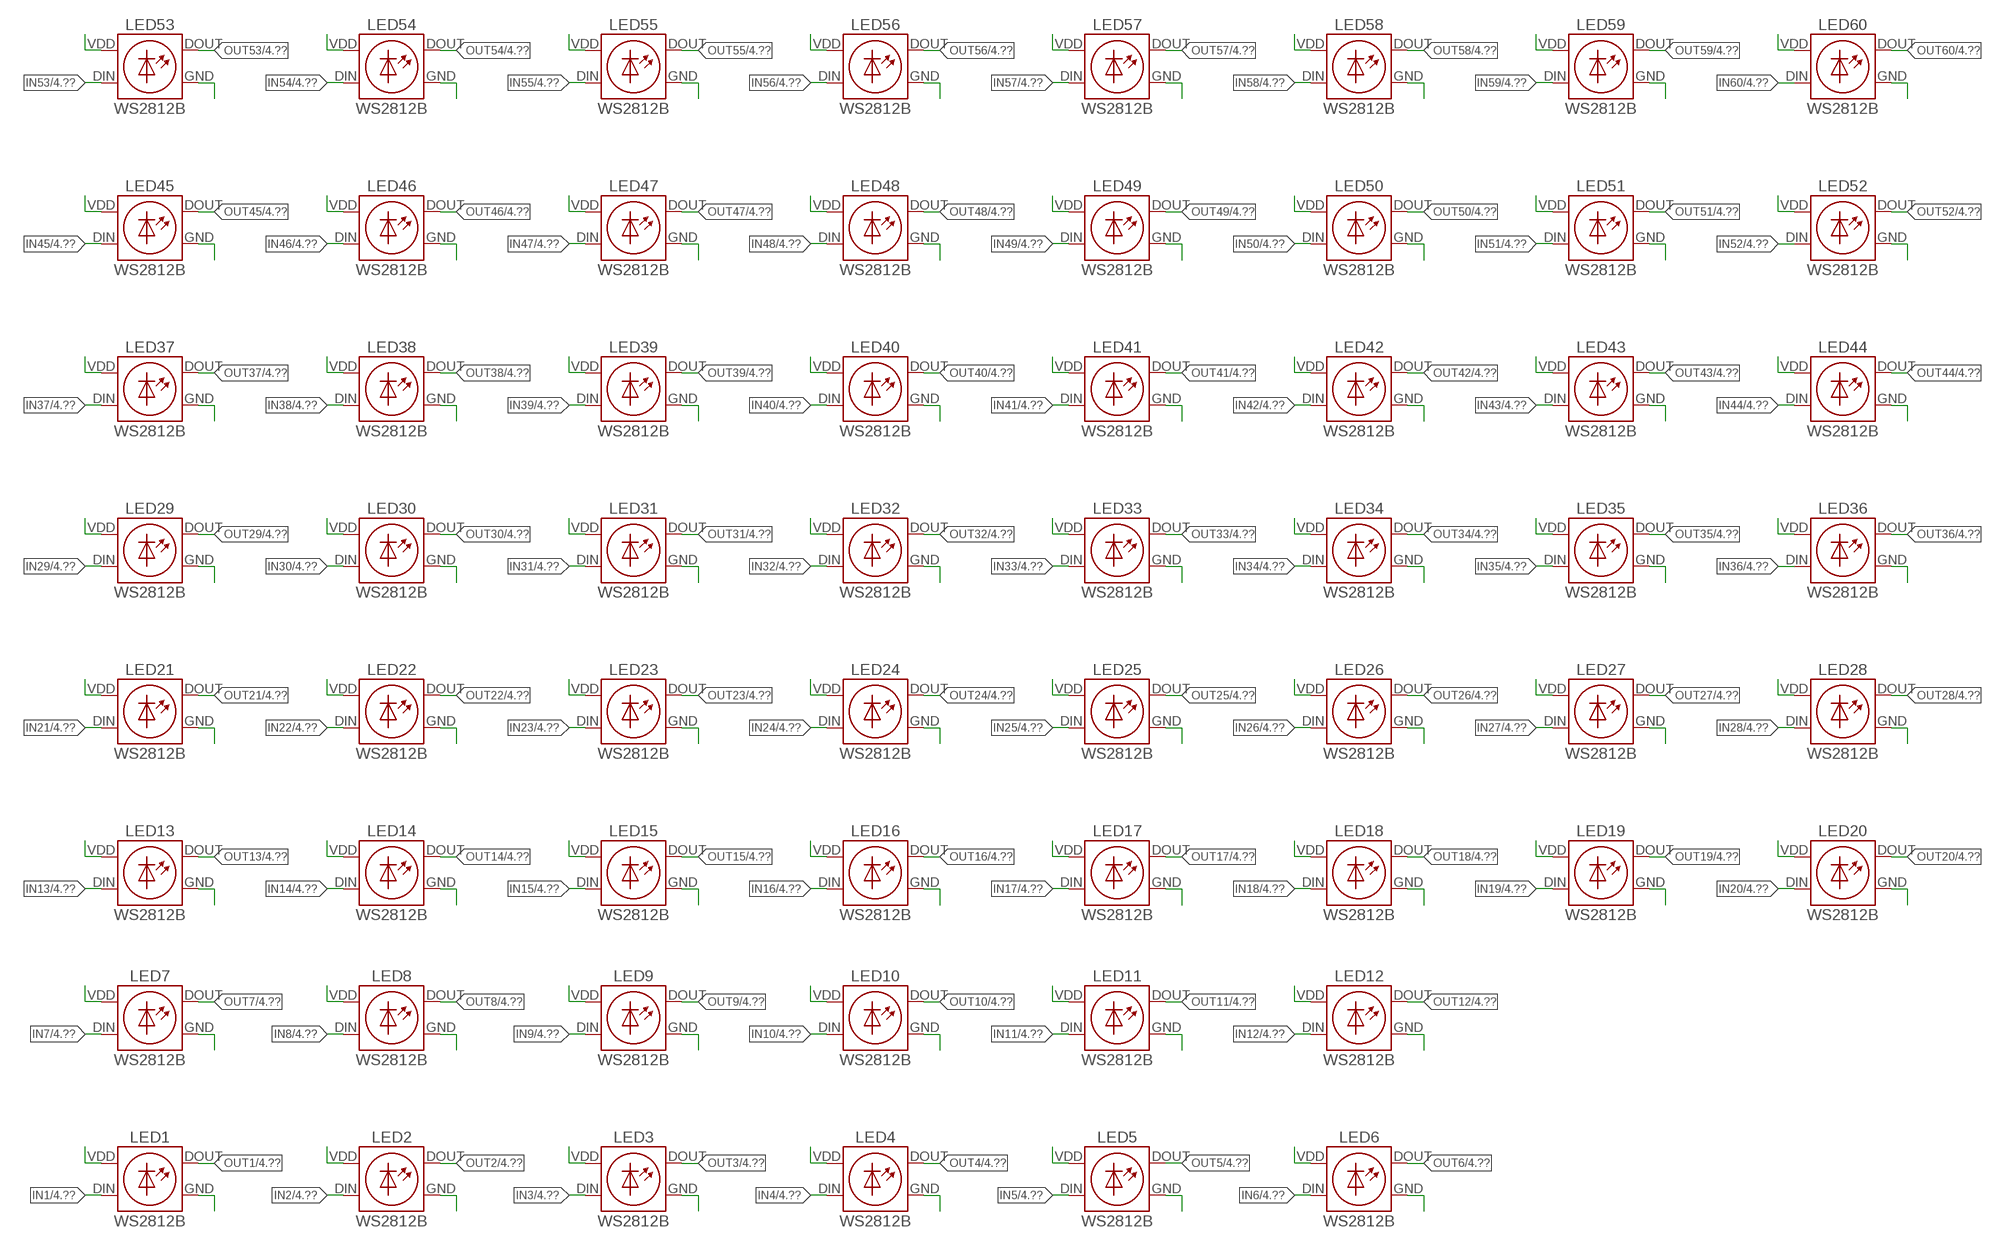
[diagram p6: schematic, sheet 3]

### Parts
LED1  WS2812B  [WS2812B]  (not fitted in variant P1)  (not fitted in variant P2)  (not fitted in variant P3)  (not fitted in variant P4)  (not fitted in variant P5)  (not fitted in variant P6)
LED2  WS2812B  [WS2812B]  (not fitted in variant P1)  (not fitted in variant P2)  (not fitted in variant P3)  (not fitted in variant P4)  (not fitted in variant P5)  (not fitted in variant P6)
LED3  WS2812B  [WS2812B]  (not fitted in variant P1)  (not fitted in variant P2)  (not fitted in variant P5)  (not fitted in variant P6)  (not fitted in variant P4)
LED4  WS2812B  [WS2812B]  (not fitted in variant P1)  (not fitted in variant P2)  (not fitted in variant P3)  (not fitted in variant P4)  (not fitted in variant P5)  (not fitted in variant P6)
LED5  WS2812B  [WS2812B]  (not fitted in variant P1)  (not fitted in variant P2)  (not fitted in variant P3)  (not fitted in variant P6)
LED6  WS2812B  [WS2812B]  (not fitted in variant P1)  (not fitted in variant P2)  (not fitted in variant P3)  (not fitted in variant P4)  (not fitted in variant P5)  (not fitted in variant P6)
LED7  WS2812B  [WS2812B]  (not fitted in variant P1)  (not fitted in variant P2)  (not fitted in variant P3)  (not fitted in variant P4)  (not fitted in variant P5)  (not fitted in variant P6)
LED8  WS2812B  [WS2812B]  (not fitted in variant P1)  (not fitted in variant P2)  (not fitted in variant P3)  (not fitted in variant P4)  (not fitted in variant P5)  (not fitted in variant P6)
LED9  WS2812B  [WS2812B]  (not fitted in variant P1)  (not fitted in variant P2)  (not fitted in variant P5)  (not fitted in variant P6)  (not fitted in variant P4)
LED10  WS2812B  [WS2812B]  (not fitted in variant P1)  (not fitted in variant P2)  (not fitted in variant P3)  (not fitted in variant P4)  (not fitted in variant P5)  (not fitted in variant P6)
LED11  WS2812B  [WS2812B]  (not fitted in variant P1)  (not fitted in variant P2)  (not fitted in variant P3)  (not fitted in variant P6)
LED12  WS2812B  [WS2812B]  (not fitted in variant P1)  (not fitted in variant P2)  (not fitted in variant P3)  (not fitted in variant P4)  (not fitted in variant P5)  (not fitted in variant P6)
LED13  WS2812B  [WS2812B]  (not fitted in variant P1)  (not fitted in variant P3)  (not fitted in variant P4)  (not fitted in variant P5)  (not fitted in variant P6)
LED14  WS2812B  [WS2812B]  (not fitted in variant P1)  (not fitted in variant P3)  (not fitted in variant P4)  (not fitted in variant P5)  (not fitted in variant P6)
LED15  WS2812B  [WS2812B]  (not fitted in variant P1)  (not fitted in variant P5)  (not fitted in variant P6)  (not fitted in variant P4)
LED16  WS2812B  [WS2812B]  (not fitted in variant P1)  (not fitted in variant P5)  (not fitted in variant P6)  (not fitted in variant P4)
LED17  WS2812B  [WS2812B]  (not fitted in variant P1)  (not fitted in variant P6)
LED18  WS2812B  [WS2812B]  (not fitted in variant P2)  (not fitted in variant P3)  (not fitted in variant P4)  (not fitted in variant P5)  (not fitted in variant P6)
LED19  WS2812B  [WS2812B]  (not fitted in variant P2)  (not fitted in variant P3)  (not fitted in variant P4)  (not fitted in variant P5)  (not fitted in variant P6)
LED20  WS2812B  [WS2812B]  (not fitted in variant P2)  (not fitted in variant P3)  (not fitted in variant P4)  (not fitted in variant P5)  (not fitted in variant P6)
LED21  WS2812B  [WS2812B]  (not fitted in variant P1)  (not fitted in variant P2)  (not fitted in variant P3)  (not fitted in variant P4)  (not fitted in variant P6)
LED22  WS2812B  [WS2812B]  (not fitted in variant P1)  (not fitted in variant P2)  (not fitted in variant P3)  (not fitted in variant P4)
LED23  WS2812B  [WS2812B]  (not fitted in variant P1)  (not fitted in variant P2)  (not fitted in variant P3)  (not fitted in variant P4)  (not fitted in variant P5)
LED24  WS2812B  [WS2812B]  (not fitted in variant P1)  (not fitted in variant P2)  (not fitted in variant P3)  (not fitted in variant P4)  (not fitted in variant P5)
LED25  WS2812B  [WS2812B]  (not fitted in variant P1)
LED26  WS2812B  [WS2812B]  (not fitted in variant P2)  (not fitted in variant P3)  (not fitted in variant P5)
LED27  WS2812B  [WS2812B]  (not fitted in variant P1)  (not fitted in variant P2)  (not fitted in variant P3)  (not fitted in variant P5)
LED28  WS2812B  [WS2812B]  (not fitted in variant P1)  (not fitted in variant P2)  (not fitted in variant P3)  (not fitted in variant P5)
LED29  WS2812B  [WS2812B]  (not fitted in variant P2)  (not fitted in variant P3)  (not fitted in variant P5)  (not fitted in variant P6)  (not fitted in variant P4)
LED30  WS2812B  [WS2812B]  (not fitted in variant P2)  (not fitted in variant P3)  (not fitted in variant P4)
LED31  WS2812B  [WS2812B]  (not fitted in variant P2)  (not fitted in variant P3)  (not fitted in variant P4)  (not fitted in variant P5)  (not fitted in variant P6)
LED32  WS2812B  [WS2812B]  (not fitted in variant P2)  (not fitted in variant P3)  (not fitted in variant P4)  (not fitted in variant P5)  (not fitted in variant P6)
LED33  WS2812B  [WS2812B]  (not fitted in variant P6)  (not fitted in variant P4)
LED34  WS2812B  [WS2812B]  (not fitted in variant P2)  (not fitted in variant P3)  (not fitted in variant P4)  (not fitted in variant P5)  (not fitted in variant P6)
LED35  WS2812B  [WS2812B]  (not fitted in variant P1)  (not fitted in variant P2)  (not fitted in variant P3)  (not fitted in variant P4)  (not fitted in variant P5)  (not fitted in variant P6)
LED36  WS2812B  [WS2812B]  (not fitted in variant P1)  (not fitted in variant P2)  (not fitted in variant P3)  (not fitted in variant P4)  (not fitted in variant P5)  (not fitted in variant P6)
LED37  WS2812B  [WS2812B]  (not fitted in variant P1)  (not fitted in variant P2)  (not fitted in variant P3)  (not fitted in variant P4)  (not fitted in variant P5)  (not fitted in variant P6)
LED38  WS2812B  [WS2812B]  (not fitted in variant P1)  (not fitted in variant P2)  (not fitted in variant P3)  (not fitted in variant P4)
LED39  WS2812B  [WS2812B]  (not fitted in variant P1)  (not fitted in variant P5)  (not fitted in variant P4)  (not fitted in variant P3)
LED40  WS2812B  [WS2812B]  (not fitted in variant P1)  (not fitted in variant P5)  (not fitted in variant P4)  (not fitted in variant P3)
LED41  WS2812B  [WS2812B]  (not fitted in variant P1)  (not fitted in variant P4)
LED42  WS2812B  [WS2812B]  (not fitted in variant P1)  (not fitted in variant P2)  (not fitted in variant P3)  (not fitted in variant P4)  (not fitted in variant P5)  (not fitted in variant P6)
LED43  WS2812B  [WS2812B]  (not fitted in variant P1)  (not fitted in variant P2)  (not fitted in variant P3)  (not fitted in variant P4)  (not fitted in variant P5)  (not fitted in variant P6)
LED44  WS2812B  [WS2812B]  (not fitted in variant P1)  (not fitted in variant P2)  (not fitted in variant P3)  (not fitted in variant P4)  (not fitted in variant P5)  (not fitted in variant P6)
LED45  WS2812B  [WS2812B]  (not fitted in variant P1)  (not fitted in variant P2)  (not fitted in variant P3)  (not fitted in variant P4)  (not fitted in variant P5)  (not fitted in variant P6)
LED46  WS2812B  [WS2812B]  (not fitted in variant P1)  (not fitted in variant P2)  (not fitted in variant P3)  (not fitted in variant P4)  (not fitted in variant P6)
LED47  WS2812B  [WS2812B]  (not fitted in variant P1)  (not fitted in variant P6)  (not fitted in variant P3)  (not fitted in variant P4)
LED48  WS2812B  [WS2812B]  (not fitted in variant P1)  (not fitted in variant P2)  (not fitted in variant P3)  (not fitted in variant P4)  (not fitted in variant P6)
LED49  WS2812B  [WS2812B]  (not fitted in variant P1)  (not fitted in variant P2)  (not fitted in variant P4)
LED50  WS2812B  [WS2812B]  (not fitted in variant P1)  (not fitted in variant P2)  (not fitted in variant P3)  (not fitted in variant P4)  (not fitted in variant P5)  (not fitted in variant P6)
LED51  WS2812B  [WS2812B]  (not fitted in variant P1)  (not fitted in variant P2)  (not fitted in variant P3)  (not fitted in variant P4)  (not fitted in variant P5)  (not fitted in variant P6)
LED52  WS2812B  [WS2812B]  (not fitted in variant P1)  (not fitted in variant P2)  (not fitted in variant P3)  (not fitted in variant P4)  (not fitted in variant P5)  (not fitted in variant P6)
LED53  WS2812B  [WS2812B]  (not fitted in variant P1)  (not fitted in variant P2)  (not fitted in variant P3)  (not fitted in variant P4)  (not fitted in variant P5)  (not fitted in variant P6)
LED54  WS2812B  [WS2812B]  (not fitted in variant P1)  (not fitted in variant P2)  (not fitted in variant P3)  (not fitted in variant P4)  (not fitted in variant P5)  (not fitted in variant P6)
LED55  WS2812B  [WS2812B]  (not fitted in variant P1)  (not fitted in variant P5)  (not fitted in variant P6)  (not fitted in variant P3)  (not fitted in variant P4)
LED56  WS2812B  [WS2812B]  (not fitted in variant P1)  (not fitted in variant P2)  (not fitted in variant P3)  (not fitted in variant P4)  (not fitted in variant P5)  (not fitted in variant P6)
LED57  WS2812B  [WS2812B]  (not fitted in variant P1)  (not fitted in variant P2)  (not fitted in variant P4)  (not fitted in variant P5)
LED58  WS2812B  [WS2812B]  (not fitted in variant P1)  (not fitted in variant P2)  (not fitted in variant P3)  (not fitted in variant P4)  (not fitted in variant P5)  (not fitted in variant P6)
LED59  WS2812B  [WS2812B]  (not fitted in variant P1)  (not fitted in variant P2)  (not fitted in variant P3)  (not fitted in variant P4)  (not fitted in variant P5)  (not fitted in variant P6)
LED60  WS2812B  [WS2812B]  (not fitted in variant P1)  (not fitted in variant P2)  (not fitted in variant P3)  (not fitted in variant P4)  (not fitted in variant P5)  (not fitted in variant P6)

### Nets
GND: LED1.GND LED2.GND LED3.GND LED4.GND LED5.GND LED6.GND LED7.GND LED8.GND LED9.GND LED10.GND LED11.GND LED12.GND LED13.GND LED14.GND LED15.GND LED16.GND LED17.GND LED18.GND LED19.GND LED20.GND LED21.GND LED22.GND LED23.GND LED24.GND LED25.GND LED26.GND LED27.GND LED28.GND LED29.GND LED30.GND LED31.GND LED32.GND LED33.GND LED34.GND LED35.GND LED36.GND LED37.GND LED38.GND LED39.GND LED40.GND LED41.GND LED42.GND LED43.GND LED44.GND LED45.GND LED46.GND LED47.GND LED48.GND LED49.GND LED50.GND LED51.GND LED52.GND LED53.GND LED54.GND LED55.GND LED56.GND LED57.GND LED58.GND LED59.GND LED60.GND ; also sheet 1
IN1: LED1.DIN ; also sheet 2,4
IN2: LED2.DIN ; also sheet 2,4
IN3: LED3.DIN ; also sheet 2,4
IN4: LED4.DIN ; also sheet 2,4
IN5: LED5.DIN ; also sheet 2,4
IN6: LED6.DIN ; also sheet 2,4
IN7: LED7.DIN ; also sheet 2,4
IN8: LED8.DIN ; also sheet 2,4
IN9: LED9.DIN ; also sheet 2,4
IN10: LED10.DIN ; also sheet 2,4
IN11: LED11.DIN ; also sheet 2,4
IN12: LED12.DIN ; also sheet 2,4
IN13: LED13.DIN ; also sheet 2,4
IN14: LED14.DIN ; also sheet 2,4
IN15: LED15.DIN ; also sheet 2,4
IN16: LED16.DIN ; also sheet 2,4
IN17: LED17.DIN ; also sheet 2,4
IN18: LED18.DIN ; also sheet 2,4
IN19: LED19.DIN ; also sheet 2,4
IN20: LED20.DIN ; also sheet 2,4
IN21: LED21.DIN ; also sheet 2,4
IN22: LED22.DIN ; also sheet 2,4
IN23: LED23.DIN ; also sheet 2,4
IN24: LED24.DIN ; also sheet 2,4
IN25: LED25.DIN ; also sheet 2,4
IN26: LED26.DIN ; also sheet 2,4
IN27: LED27.DIN ; also sheet 2,4
IN28: LED28.DIN ; also sheet 2,4
IN29: LED29.DIN ; also sheet 2,4
IN30: LED30.DIN ; also sheet 2,4
IN31: LED31.DIN ; also sheet 2,4
IN32: LED32.DIN ; also sheet 2,4
IN33: LED33.DIN ; also sheet 2,4
IN34: LED34.DIN ; also sheet 2,4
IN35: LED35.DIN ; also sheet 2,4
IN36: LED36.DIN ; also sheet 2,4
IN37: LED37.DIN ; also sheet 2,4
IN38: LED38.DIN ; also sheet 2,4
IN39: LED39.DIN ; also sheet 2,4
IN40: LED40.DIN ; also sheet 2,4
IN41: LED41.DIN ; also sheet 2,4
IN42: LED42.DIN ; also sheet 2,4
IN43: LED43.DIN ; also sheet 2,4
IN44: LED44.DIN ; also sheet 2,4
IN45: LED45.DIN ; also sheet 2,4
IN46: LED46.DIN ; also sheet 2,4
IN47: LED47.DIN ; also sheet 2,4
IN48: LED48.DIN ; also sheet 2,4
IN49: LED49.DIN ; also sheet 2,4
IN50: LED50.DIN ; also sheet 2,4
IN51: LED51.DIN ; also sheet 2,4
IN52: LED52.DIN ; also sheet 2,4
IN53: LED53.DIN ; also sheet 2,4
IN54: LED54.DIN ; also sheet 2,4
IN55: LED55.DIN ; also sheet 2,4
IN56: LED56.DIN ; also sheet 2,4
IN57: LED57.DIN ; also sheet 2,4
IN58: LED58.DIN ; also sheet 2,4
IN59: LED59.DIN ; also sheet 2,4
IN60: LED60.DIN ; also sheet 2,4
OUT1: LED1.DOUT ; also sheet 2,4
OUT2: LED2.DOUT ; also sheet 2,4
OUT3: LED3.DOUT ; also sheet 2,4
OUT4: LED4.DOUT ; also sheet 2,4
OUT5: LED5.DOUT ; also sheet 2,4
OUT6: LED6.DOUT ; also sheet 2,4
OUT7: LED7.DOUT ; also sheet 2,4
OUT8: LED8.DOUT ; also sheet 2,4
OUT9: LED9.DOUT ; also sheet 2,4
OUT10: LED10.DOUT ; also sheet 2,4
OUT11: LED11.DOUT ; also sheet 2,4
OUT12: LED12.DOUT ; also sheet 2,4
OUT13: LED13.DOUT ; also sheet 2,4
OUT14: LED14.DOUT ; also sheet 2,4
OUT15: LED15.DOUT ; also sheet 2,4
OUT16: LED16.DOUT ; also sheet 2,4
OUT17: LED17.DOUT ; also sheet 2,4
OUT18: LED18.DOUT ; also sheet 2,4
OUT19: LED19.DOUT ; also sheet 2,4
OUT20: LED20.DOUT ; also sheet 2,4
OUT21: LED21.DOUT ; also sheet 2,4
OUT22: LED22.DOUT ; also sheet 2,4
OUT23: LED23.DOUT ; also sheet 2,4
OUT24: LED24.DOUT ; also sheet 2,4
OUT25: LED25.DOUT ; also sheet 2,4
OUT26: LED26.DOUT ; also sheet 2,4
OUT27: LED27.DOUT ; also sheet 2,4
OUT28: LED28.DOUT ; also sheet 2,4
OUT29: LED29.DOUT ; also sheet 2,4
OUT30: LED30.DOUT ; also sheet 2,4
OUT31: LED31.DOUT ; also sheet 2,4
OUT32: LED32.DOUT ; also sheet 2,4
OUT33: LED33.DOUT ; also sheet 2,4
OUT34: LED34.DOUT ; also sheet 2,4
OUT35: LED35.DOUT ; also sheet 2,4
OUT36: LED36.DOUT ; also sheet 2,4
OUT37: LED37.DOUT ; also sheet 2,4
OUT38: LED38.DOUT ; also sheet 2,4
OUT39: LED39.DOUT ; also sheet 2,4
OUT40: LED40.DOUT ; also sheet 2,4
OUT41: LED41.DOUT ; also sheet 2,4
OUT42: LED42.DOUT ; also sheet 2,4
OUT43: LED43.DOUT ; also sheet 2,4
OUT44: LED44.DOUT ; also sheet 2,4
OUT45: LED45.DOUT ; also sheet 2,4
OUT46: LED46.DOUT ; also sheet 2,4
OUT47: LED47.DOUT ; also sheet 2,4
OUT48: LED48.DOUT ; also sheet 2,4
OUT49: LED49.DOUT ; also sheet 2,4
OUT50: LED50.DOUT ; also sheet 2,4
OUT51: LED51.DOUT ; also sheet 2,4
OUT52: LED52.DOUT ; also sheet 2,4
OUT53: LED53.DOUT ; also sheet 2,4
OUT54: LED54.DOUT ; also sheet 2,4
OUT55: LED55.DOUT ; also sheet 2,4
OUT56: LED56.DOUT ; also sheet 2,4
OUT57: LED57.DOUT ; also sheet 2,4
OUT58: LED58.DOUT ; also sheet 2,4
OUT59: LED59.DOUT ; also sheet 2,4
OUT60: LED60.DOUT ; also sheet 2,4
VCC: LED1.VDD(VCC) LED2.VDD(VCC) LED3.VDD(VCC) LED4.VDD(VCC) LED5.VDD(VCC) LED6.VDD(VCC) LED7.VDD(VCC) LED8.VDD(VCC) LED9.VDD(VCC) LED10.VDD(VCC) LED11.VDD(VCC) LED12.VDD(VCC) LED13.VDD(VCC) LED14.VDD(VCC) LED15.VDD(VCC) LED16.VDD(VCC) LED17.VDD(VCC) LED18.VDD(VCC) LED19.VDD(VCC) LED20.VDD(VCC) LED21.VDD(VCC) LED22.VDD(VCC) LED23.VDD(VCC) LED24.VDD(VCC) LED25.VDD(VCC) LED26.VDD(VCC) LED27.VDD(VCC) LED28.VDD(VCC) LED29.VDD(VCC) LED30.VDD(VCC) LED31.VDD(VCC) LED32.VDD(VCC) LED33.VDD(VCC) LED34.VDD(VCC) LED35.VDD(VCC) LED36.VDD(VCC) LED37.VDD(VCC) LED38.VDD(VCC) LED39.VDD(VCC) LED40.VDD(VCC) LED41.VDD(VCC) LED42.VDD(VCC) LED43.VDD(VCC) LED44.VDD(VCC) LED45.VDD(VCC) LED46.VDD(VCC) LED47.VDD(VCC) LED48.VDD(VCC) LED49.VDD(VCC) LED50.VDD(VCC) LED51.VDD(VCC) LED52.VDD(VCC) LED53.VDD(VCC) LED54.VDD(VCC) LED55.VDD(VCC) LED56.VDD(VCC) LED57.VDD(VCC) LED58.VDD(VCC) LED59.VDD(VCC) LED60.VDD(VCC) ; also sheet 1

## Sheet 4 of 4
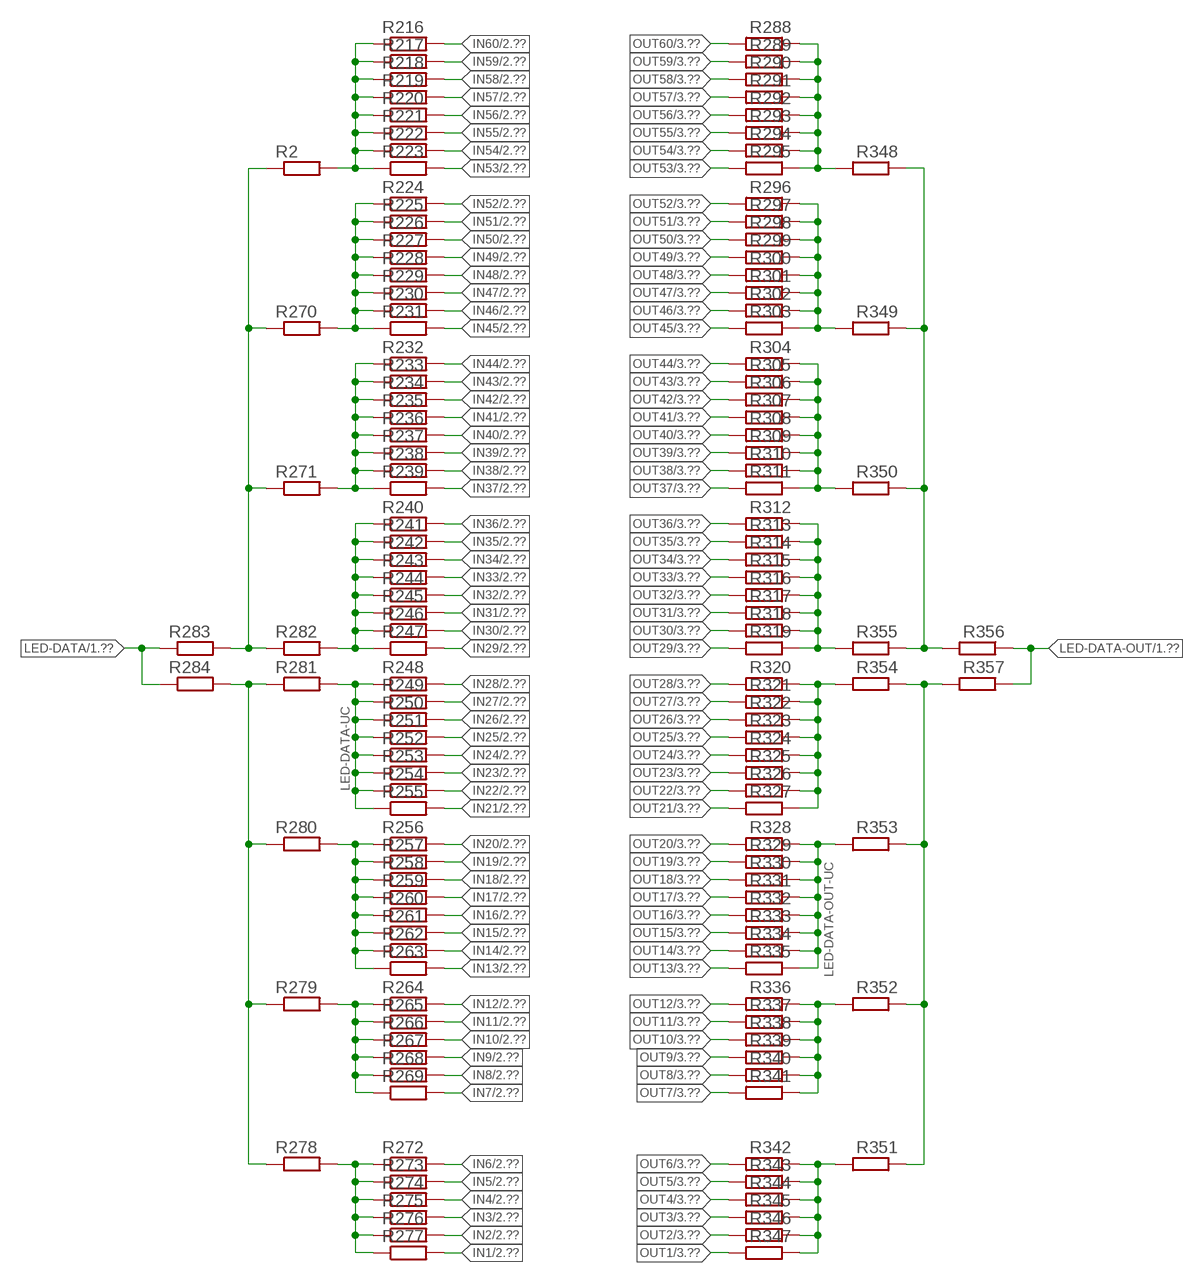
[diagram p7: schematic, sheet 4]

### Parts
R2  WIDERSTAND-0603  [0603]
R216  WIDERSTAND-0603  [0603]
R217  WIDERSTAND-0603  [0603]
R218  WIDERSTAND-0603  [0603]
R219  WIDERSTAND-0603  [0603]
R220  WIDERSTAND-0603  [0603]
R221  WIDERSTAND-0603  [0603]
R222  WIDERSTAND-0603  [0603]
R223  WIDERSTAND-0603  [0603]
R224  WIDERSTAND-0603  [0603]
R225  WIDERSTAND-0603  [0603]
R226  WIDERSTAND-0603  [0603]
R227  WIDERSTAND-0603  [0603]
R228  WIDERSTAND-0603  [0603]
R229  WIDERSTAND-0603  [0603]
R230  WIDERSTAND-0603  [0603]
R231  WIDERSTAND-0603  [0603]
R232  WIDERSTAND-0603  [0603]
R233  WIDERSTAND-0603  [0603]
R234  WIDERSTAND-0603  [0603]
R235  WIDERSTAND-0603  [0603]
R236  WIDERSTAND-0603  [0603]
R237  WIDERSTAND-0603  [0603]
R238  WIDERSTAND-0603  [0603]
R239  WIDERSTAND-0603  [0603]
R240  WIDERSTAND-0603  [0603]
R241  WIDERSTAND-0603  [0603]
R242  WIDERSTAND-0603  [0603]
R243  WIDERSTAND-0603  [0603]
R244  WIDERSTAND-0603  [0603]
R245  WIDERSTAND-0603  [0603]
R246  WIDERSTAND-0603  [0603]
R247  WIDERSTAND-0603  [0603]
R248  WIDERSTAND-0603  [0603]
R249  WIDERSTAND-0603  [0603]
R250  WIDERSTAND-0603  [0603]
R251  WIDERSTAND-0603  [0603]
R252  WIDERSTAND-0603  [0603]
R253  WIDERSTAND-0603  [0603]
R254  WIDERSTAND-0603  [0603]
R255  WIDERSTAND-0603  [0603]
R256  WIDERSTAND-0603  [0603]
R257  WIDERSTAND-0603  [0603]
R258  WIDERSTAND-0603  [0603]
R259  WIDERSTAND-0603  [0603]
R260  WIDERSTAND-0603  [0603]
R261  WIDERSTAND-0603  [0603]
R262  WIDERSTAND-0603  [0603]
R263  WIDERSTAND-0603  [0603]
R264  WIDERSTAND-0603  [0603]
R265  WIDERSTAND-0603  [0603]
R266  WIDERSTAND-0603  [0603]
R267  WIDERSTAND-0603  [0603]
R268  WIDERSTAND-0603  [0603]
R269  WIDERSTAND-0603  [0603]
R270  WIDERSTAND-0603  [0603]
R271  WIDERSTAND-0603  [0603]
R272  WIDERSTAND-0603  [0603]
R273  WIDERSTAND-0603  [0603]
R274  WIDERSTAND-0603  [0603]
R275  WIDERSTAND-0603  [0603]
R276  WIDERSTAND-0603  [0603]
R277  WIDERSTAND-0603  [0603]
R278  WIDERSTAND-0603  [0603]
R279  WIDERSTAND-0603  [0603]
R280  WIDERSTAND-0603  [0603]
R281  WIDERSTAND-0603  [0603]
R282  WIDERSTAND-0603  [0603]
R283  WIDERSTAND-0603  [0603]
R284  WIDERSTAND-0603  [0603]
R288  WIDERSTAND-0603  [0603]
R289  WIDERSTAND-0603  [0603]
R290  WIDERSTAND-0603  [0603]
R291  WIDERSTAND-0603  [0603]
R292  WIDERSTAND-0603  [0603]
R293  WIDERSTAND-0603  [0603]
R294  WIDERSTAND-0603  [0603]
R295  WIDERSTAND-0603  [0603]
R296  WIDERSTAND-0603  [0603]
R297  WIDERSTAND-0603  [0603]
R298  WIDERSTAND-0603  [0603]
R299  WIDERSTAND-0603  [0603]
R300  WIDERSTAND-0603  [0603]
R301  WIDERSTAND-0603  [0603]
R302  WIDERSTAND-0603  [0603]
R303  WIDERSTAND-0603  [0603]
R304  WIDERSTAND-0603  [0603]
R305  WIDERSTAND-0603  [0603]
R306  WIDERSTAND-0603  [0603]
R307  WIDERSTAND-0603  [0603]
R308  WIDERSTAND-0603  [0603]
R309  WIDERSTAND-0603  [0603]
R310  WIDERSTAND-0603  [0603]
R311  WIDERSTAND-0603  [0603]
R312  WIDERSTAND-0603  [0603]
R313  WIDERSTAND-0603  [0603]
R314  WIDERSTAND-0603  [0603]
R315  WIDERSTAND-0603  [0603]
R316  WIDERSTAND-0603  [0603]
R317  WIDERSTAND-0603  [0603]
R318  WIDERSTAND-0603  [0603]
R319  WIDERSTAND-0603  [0603]
R320  WIDERSTAND-0603  [0603]
R321  WIDERSTAND-0603  [0603]
R322  WIDERSTAND-0603  [0603]
R323  WIDERSTAND-0603  [0603]
R324  WIDERSTAND-0603  [0603]
R325  WIDERSTAND-0603  [0603]
R326  WIDERSTAND-0603  [0603]
R327  WIDERSTAND-0603  [0603]
R328  WIDERSTAND-0603  [0603]
R329  WIDERSTAND-0603  [0603]
R330  WIDERSTAND-0603  [0603]
R331  WIDERSTAND-0603  [0603]
R332  WIDERSTAND-0603  [0603]
R333  WIDERSTAND-0603  [0603]
R334  WIDERSTAND-0603  [0603]
R335  WIDERSTAND-0603  [0603]
R336  WIDERSTAND-0603  [0603]
R337  WIDERSTAND-0603  [0603]
R338  WIDERSTAND-0603  [0603]
R339  WIDERSTAND-0603  [0603]
R340  WIDERSTAND-0603  [0603]
R341  WIDERSTAND-0603  [0603]
R342  WIDERSTAND-0603  [0603]
R343  WIDERSTAND-0603  [0603]
R344  WIDERSTAND-0603  [0603]
R345  WIDERSTAND-0603  [0603]
R346  WIDERSTAND-0603  [0603]
R347  WIDERSTAND-0603  [0603]
R348  WIDERSTAND-0603  [0603]
R349  WIDERSTAND-0603  [0603]
R350  WIDERSTAND-0603  [0603]
R351  WIDERSTAND-0603  [0603]
R352  WIDERSTAND-0603  [0603]
R353  WIDERSTAND-0603  [0603]
R354  WIDERSTAND-0603  [0603]
R355  WIDERSTAND-0603  [0603]
R356  WIDERSTAND-0603  [0603]
R357  WIDERSTAND-0603  [0603]

### Nets
IN1: R277.P$2 ; also sheet 2,3
IN2: R276.P$2 ; also sheet 2,3
IN3: R275.P$2 ; also sheet 2,3
IN4: R274.P$2 ; also sheet 2,3
IN5: R273.P$2 ; also sheet 2,3
IN6: R272.P$2 ; also sheet 2,3
IN7: R269.P$2 ; also sheet 2,3
IN8: R268.P$2 ; also sheet 2,3
IN9: R267.P$2 ; also sheet 2,3
IN10: R266.P$2 ; also sheet 2,3
IN11: R265.P$2 ; also sheet 2,3
IN12: R264.P$2 ; also sheet 2,3
IN13: R263.P$2 ; also sheet 2,3
IN14: R262.P$2 ; also sheet 2,3
IN15: R261.P$2 ; also sheet 2,3
IN16: R260.P$2 ; also sheet 2,3
IN17: R259.P$2 ; also sheet 2,3
IN18: R258.P$2 ; also sheet 2,3
IN19: R257.P$2 ; also sheet 2,3
IN20: R256.P$2 ; also sheet 2,3
IN21: R255.P$2 ; also sheet 2,3
IN22: R254.P$2 ; also sheet 2,3
IN23: R253.P$2 ; also sheet 2,3
IN24: R252.P$2 ; also sheet 2,3
IN25: R251.P$2 ; also sheet 2,3
IN26: R250.P$2 ; also sheet 2,3
IN27: R249.P$2 ; also sheet 2,3
IN28: R248.P$2 ; also sheet 2,3
IN29: R247.P$2 ; also sheet 2,3
IN30: R246.P$2 ; also sheet 2,3
IN31: R245.P$2 ; also sheet 2,3
IN32: R244.P$2 ; also sheet 2,3
IN33: R243.P$2 ; also sheet 2,3
IN34: R242.P$2 ; also sheet 2,3
IN35: R241.P$2 ; also sheet 2,3
IN36: R240.P$2 ; also sheet 2,3
IN37: R239.P$2 ; also sheet 2,3
IN38: R238.P$2 ; also sheet 2,3
IN39: R237.P$2 ; also sheet 2,3
IN40: R236.P$2 ; also sheet 2,3
IN41: R235.P$2 ; also sheet 2,3
IN42: R234.P$2 ; also sheet 2,3
IN43: R233.P$2 ; also sheet 2,3
IN44: R232.P$2 ; also sheet 2,3
IN45: R231.P$2 ; also sheet 2,3
IN46: R230.P$2 ; also sheet 2,3
IN47: R229.P$2 ; also sheet 2,3
IN48: R228.P$2 ; also sheet 2,3
IN49: R227.P$2 ; also sheet 2,3
IN50: R226.P$2 ; also sheet 2,3
IN51: R225.P$2 ; also sheet 2,3
IN52: R224.P$2 ; also sheet 2,3
IN53: R223.P$2 ; also sheet 2,3
IN54: R222.P$2 ; also sheet 2,3
IN55: R221.P$2 ; also sheet 2,3
IN56: R220.P$2 ; also sheet 2,3
IN57: R219.P$2 ; also sheet 2,3
IN58: R218.P$2 ; also sheet 2,3
IN59: R217.P$2 ; also sheet 2,3
IN60: R216.P$2 ; also sheet 2,3
LED-DATA: R283.P$1 R284.P$1 ; also sheet 1
LED-DATA-OUT: R356.P$1 R357.P$1 ; also sheet 1
LED-DATA-OUT-UC: R328.P$1 R329.P$1 R330.P$1 R331.P$1 R332.P$1 R333.P$1 R334.P$1 R335.P$1 R353.P$2 ; also sheet 1
LED-DATA-UC: R248.P$1 R249.P$1 R250.P$1 R251.P$1 R252.P$1 R253.P$1 R254.P$1 R255.P$1 R281.P$2 ; also sheet 1
N$1: R278.P$1 R279.P$1 R280.P$1 R281.P$1 R284.P$2
N$5: R2.P$1 R270.P$1 R271.P$1 R282.P$1 R283.P$2
N$7: R288.P$1 R289.P$1 R290.P$1 R291.P$1 R292.P$1 R293.P$1 R294.P$1 R295.P$1 R348.P$2
N$8: R296.P$1 R297.P$1 R298.P$1 R299.P$1 R300.P$1 R301.P$1 R302.P$1 R303.P$1 R349.P$2
N$9: R304.P$1 R305.P$1 R306.P$1 R307.P$1 R308.P$1 R309.P$1 R310.P$1 R311.P$1 R350.P$2
N$10: R312.P$1 R313.P$1 R314.P$1 R315.P$1 R316.P$1 R317.P$1 R318.P$1 R319.P$1 R355.P$2
N$11: R320.P$1 R321.P$1 R322.P$1 R323.P$1 R324.P$1 R325.P$1 R326.P$1 R327.P$1 R354.P$2
N$12: R2.P$2 R216.P$1 R217.P$1 R218.P$1 R219.P$1 R220.P$1 R221.P$1 R222.P$1 R223.P$1
N$14: R336.P$1 R337.P$1 R338.P$1 R339.P$1 R340.P$1 R341.P$1 R352.P$2
N$15: R342.P$1 R343.P$1 R344.P$1 R345.P$1 R346.P$1 R347.P$1 R351.P$2
N$16: R351.P$1 R352.P$1 R353.P$1 R354.P$1 R357.P$2
N$17: R348.P$1 R349.P$1 R350.P$1 R355.P$1 R356.P$2
N$22: R224.P$1 R225.P$1 R226.P$1 R227.P$1 R228.P$1 R229.P$1 R230.P$1 R231.P$1 R270.P$2
N$32: R232.P$1 R233.P$1 R234.P$1 R235.P$1 R236.P$1 R237.P$1 R238.P$1 R239.P$1 R271.P$2
N$42: R240.P$1 R241.P$1 R242.P$1 R243.P$1 R244.P$1 R245.P$1 R246.P$1 R247.P$1 R282.P$2
N$60: R256.P$1 R257.P$1 R258.P$1 R259.P$1 R260.P$1 R261.P$1 R262.P$1 R263.P$1 R280.P$2
N$69: R264.P$1 R265.P$1 R266.P$1 R267.P$1 R268.P$1 R269.P$1 R279.P$2
N$78: R272.P$1 R273.P$1 R274.P$1 R275.P$1 R276.P$1 R277.P$1 R278.P$2
OUT1: R347.P$2 ; also sheet 2,3
OUT2: R346.P$2 ; also sheet 2,3
OUT3: R345.P$2 ; also sheet 2,3
OUT4: R344.P$2 ; also sheet 2,3
OUT5: R343.P$2 ; also sheet 2,3
OUT6: R342.P$2 ; also sheet 2,3
OUT7: R341.P$2 ; also sheet 2,3
OUT8: R340.P$2 ; also sheet 2,3
OUT9: R339.P$2 ; also sheet 2,3
OUT10: R338.P$2 ; also sheet 2,3
OUT11: R337.P$2 ; also sheet 2,3
OUT12: R336.P$2 ; also sheet 2,3
OUT13: R335.P$2 ; also sheet 2,3
OUT14: R334.P$2 ; also sheet 2,3
OUT15: R333.P$2 ; also sheet 2,3
OUT16: R332.P$2 ; also sheet 2,3
OUT17: R331.P$2 ; also sheet 2,3
OUT18: R330.P$2 ; also sheet 2,3
OUT19: R329.P$2 ; also sheet 2,3
OUT20: R328.P$2 ; also sheet 2,3
OUT21: R327.P$2 ; also sheet 2,3
OUT22: R326.P$2 ; also sheet 2,3
OUT23: R325.P$2 ; also sheet 2,3
OUT24: R324.P$2 ; also sheet 2,3
OUT25: R323.P$2 ; also sheet 2,3
OUT26: R322.P$2 ; also sheet 2,3
OUT27: R321.P$2 ; also sheet 2,3
OUT28: R320.P$2 ; also sheet 2,3
OUT29: R319.P$2 ; also sheet 2,3
OUT30: R318.P$2 ; also sheet 2,3
OUT31: R317.P$2 ; also sheet 2,3
OUT32: R316.P$2 ; also sheet 2,3
OUT33: R315.P$2 ; also sheet 2,3
OUT34: R314.P$2 ; also sheet 2,3
OUT35: R313.P$2 ; also sheet 2,3
OUT36: R312.P$2 ; also sheet 2,3
OUT37: R311.P$2 ; also sheet 2,3
OUT38: R310.P$2 ; also sheet 2,3
OUT39: R309.P$2 ; also sheet 2,3
OUT40: R308.P$2 ; also sheet 2,3
OUT41: R307.P$2 ; also sheet 2,3
OUT42: R306.P$2 ; also sheet 2,3
OUT43: R305.P$2 ; also sheet 2,3
OUT44: R304.P$2 ; also sheet 2,3
OUT45: R303.P$2 ; also sheet 2,3
OUT46: R302.P$2 ; also sheet 2,3
OUT47: R301.P$2 ; also sheet 2,3
OUT48: R300.P$2 ; also sheet 2,3
OUT49: R299.P$2 ; also sheet 2,3
OUT50: R298.P$2 ; also sheet 2,3
OUT51: R297.P$2 ; also sheet 2,3
OUT52: R296.P$2 ; also sheet 2,3
OUT53: R295.P$2 ; also sheet 2,3
OUT54: R294.P$2 ; also sheet 2,3
OUT55: R293.P$2 ; also sheet 2,3
OUT56: R292.P$2 ; also sheet 2,3
OUT57: R291.P$2 ; also sheet 2,3
OUT58: R290.P$2 ; also sheet 2,3
OUT59: R289.P$2 ; also sheet 2,3
OUT60: R288.P$2 ; also sheet 2,3

## Library data of the parts
C1-C63 = _Passive:KONDENSATOR; PDP_NAME: Keramikkondensator, 0603, %VALUE%
IC1 = _ICs:MBI5041
IC2 = _Microcontroller:ATTINY(261/461/861)V
LED1-LED60 = _LED:WS2812
LED61 LED62 = _LED:INND-TS40*AB
Q1 = _Transistor:DUAL_BJT_NPN_BIAS; MF: Nexperia; MPN: PUMH2,115; PDP-NAME: Transistor, 50V, 100mA, dual, digital, SOT363
R1-R357 = _Passive:WIDERSTAND; PDP_NAME: Chipwiderstand, 0603, %VALUE%
TP1-TP6 = _Messpunkte:TP
X2 = jumper:JP8E